# EAGLE board BMS-master (EAGLE 6.5.0), part 1 of 3
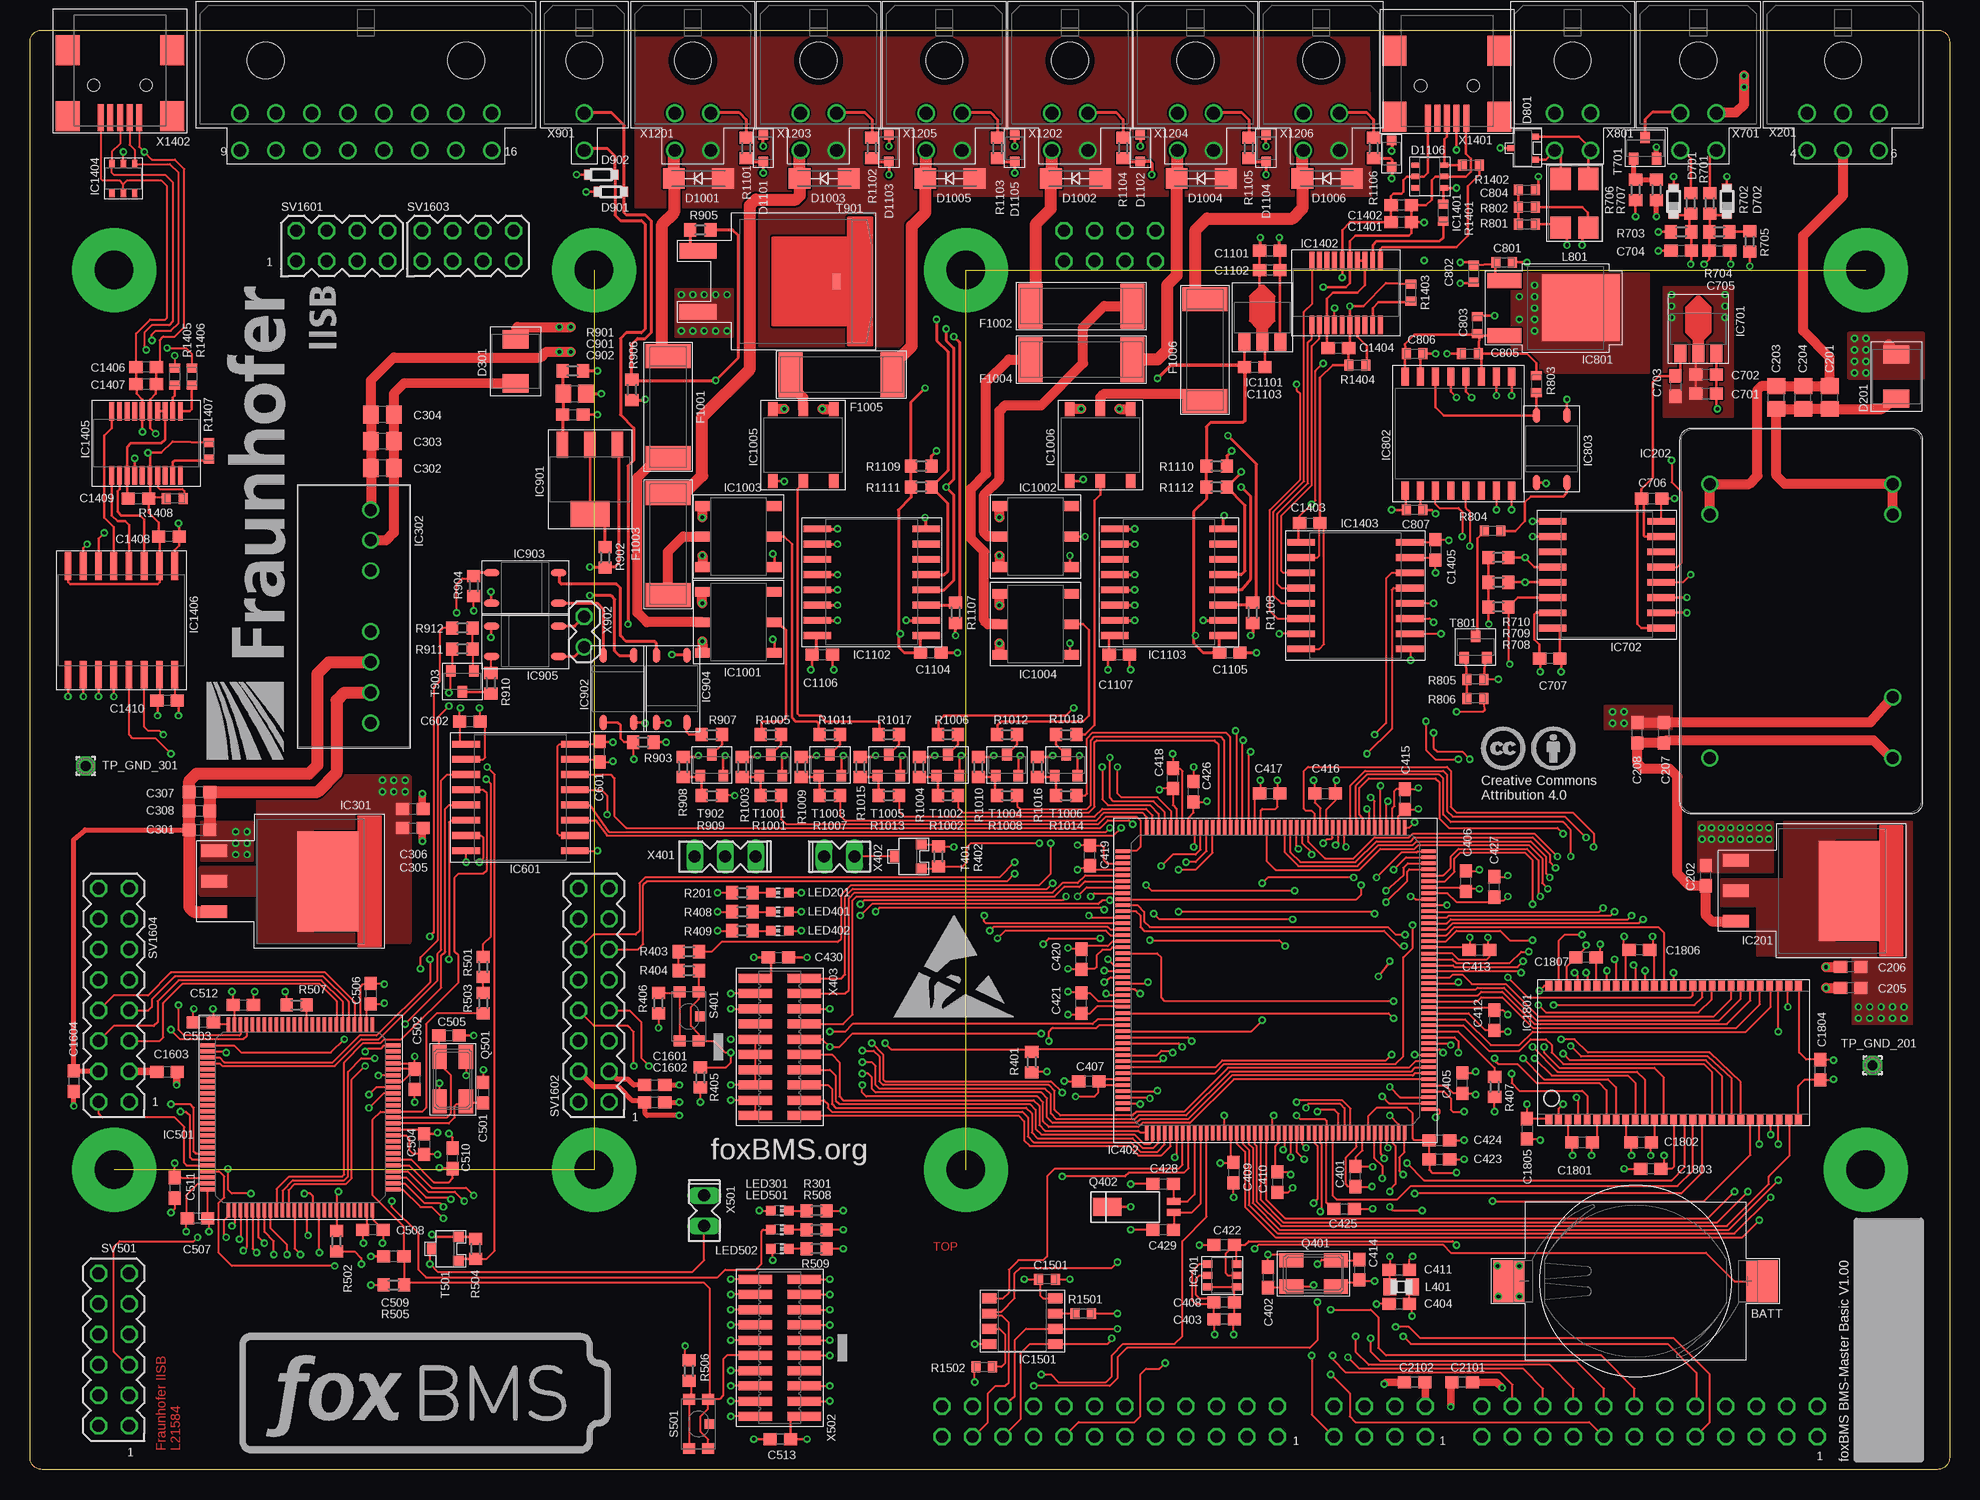
[diagram p22: board, top side]
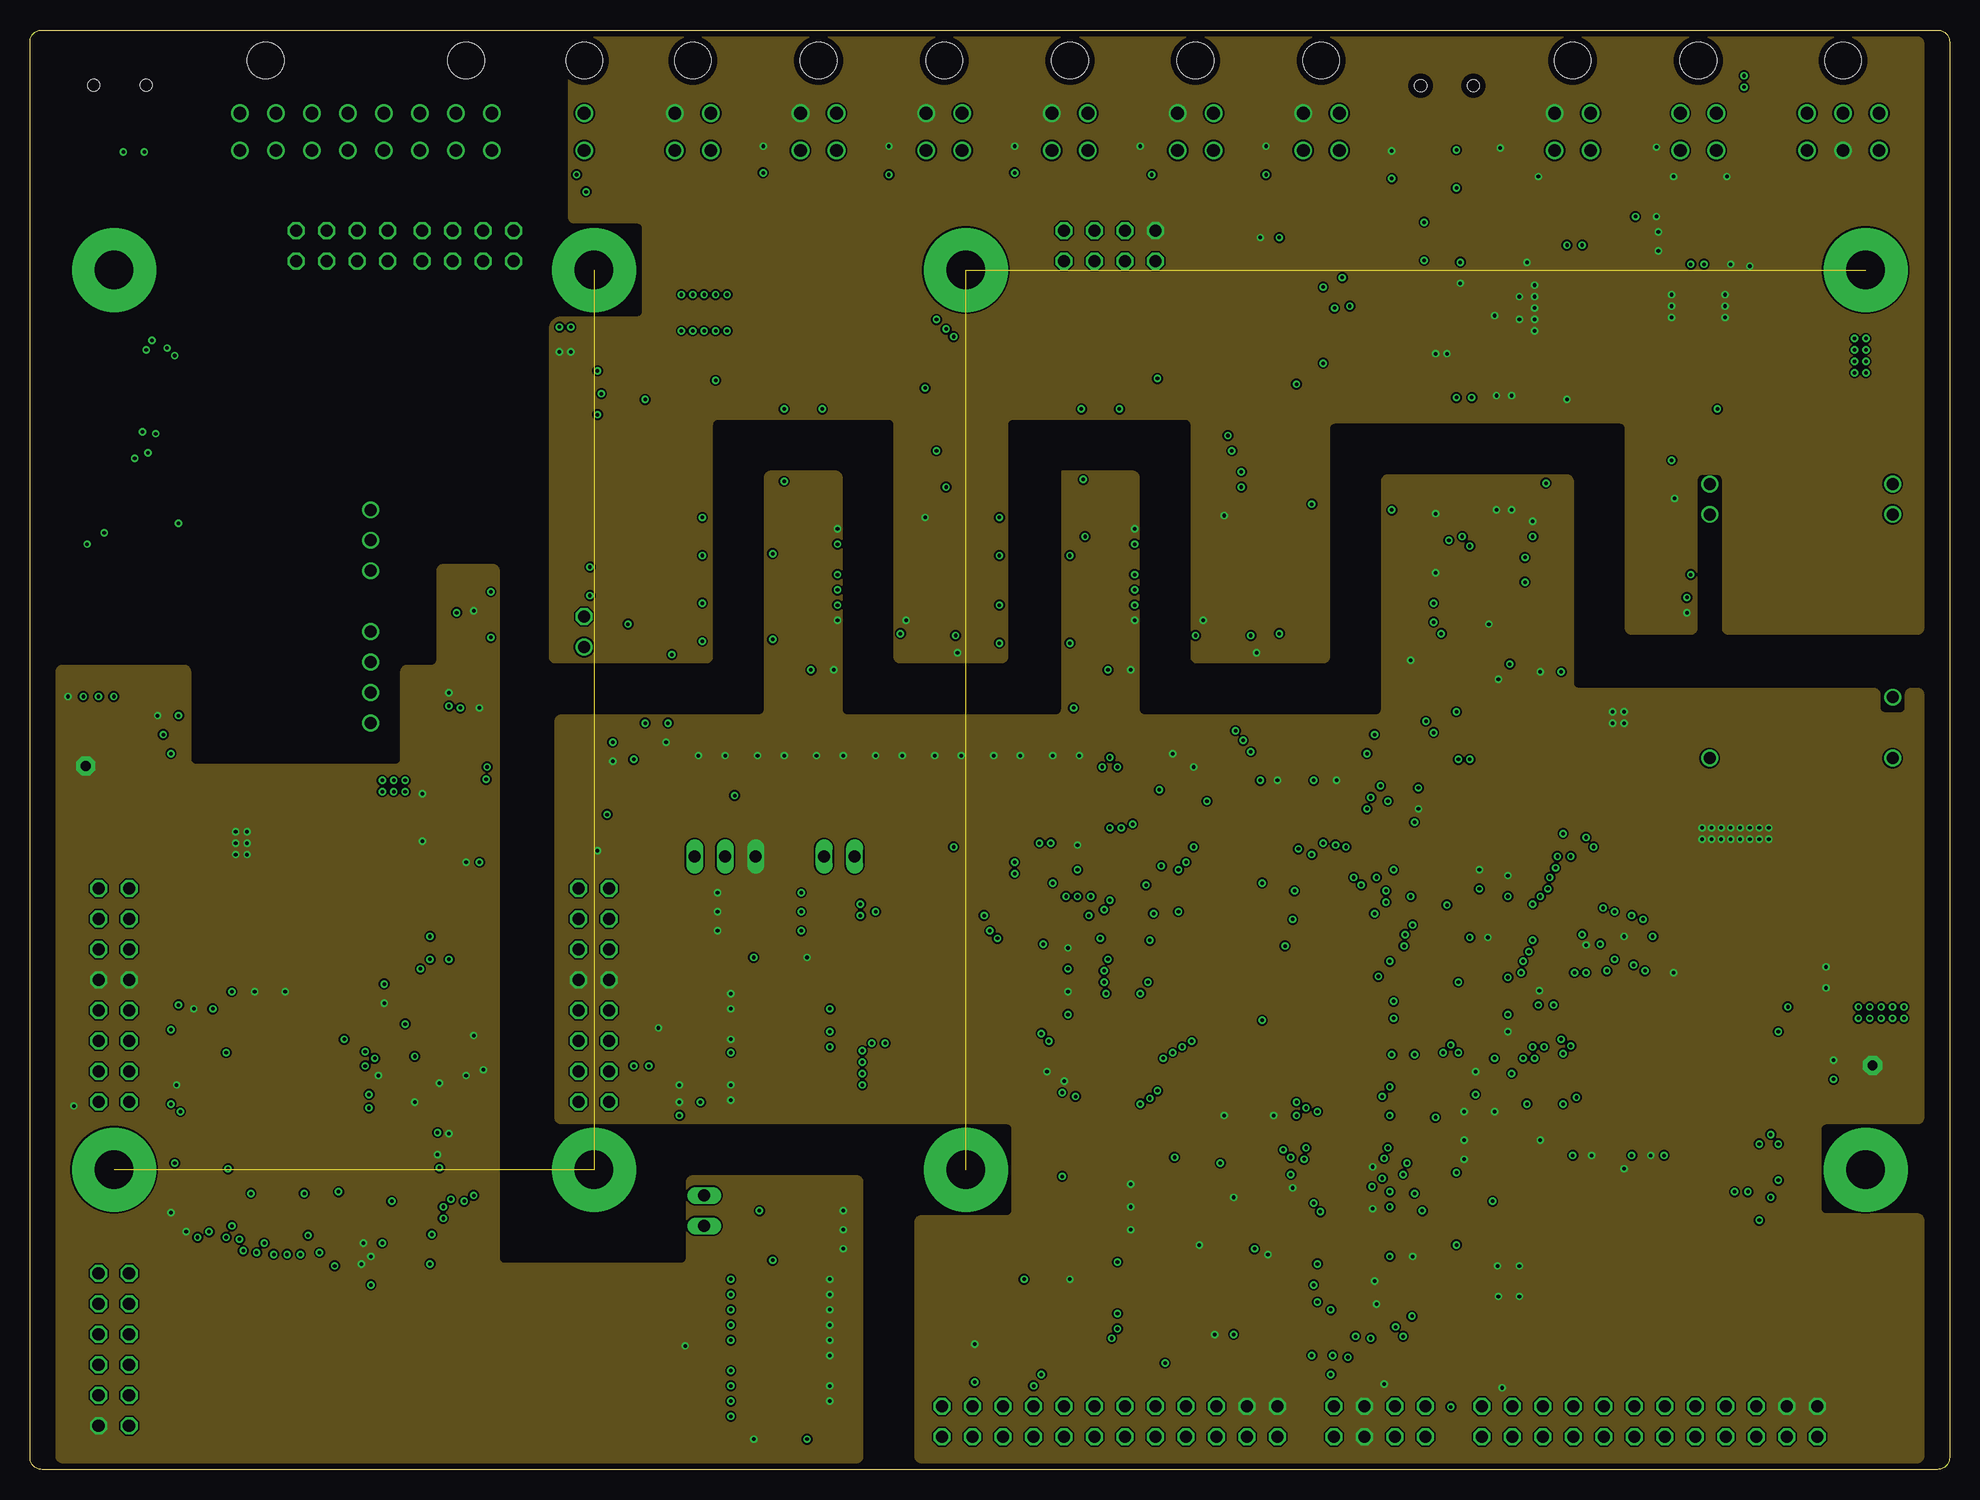
[diagram p23: board, inner layer Route2]
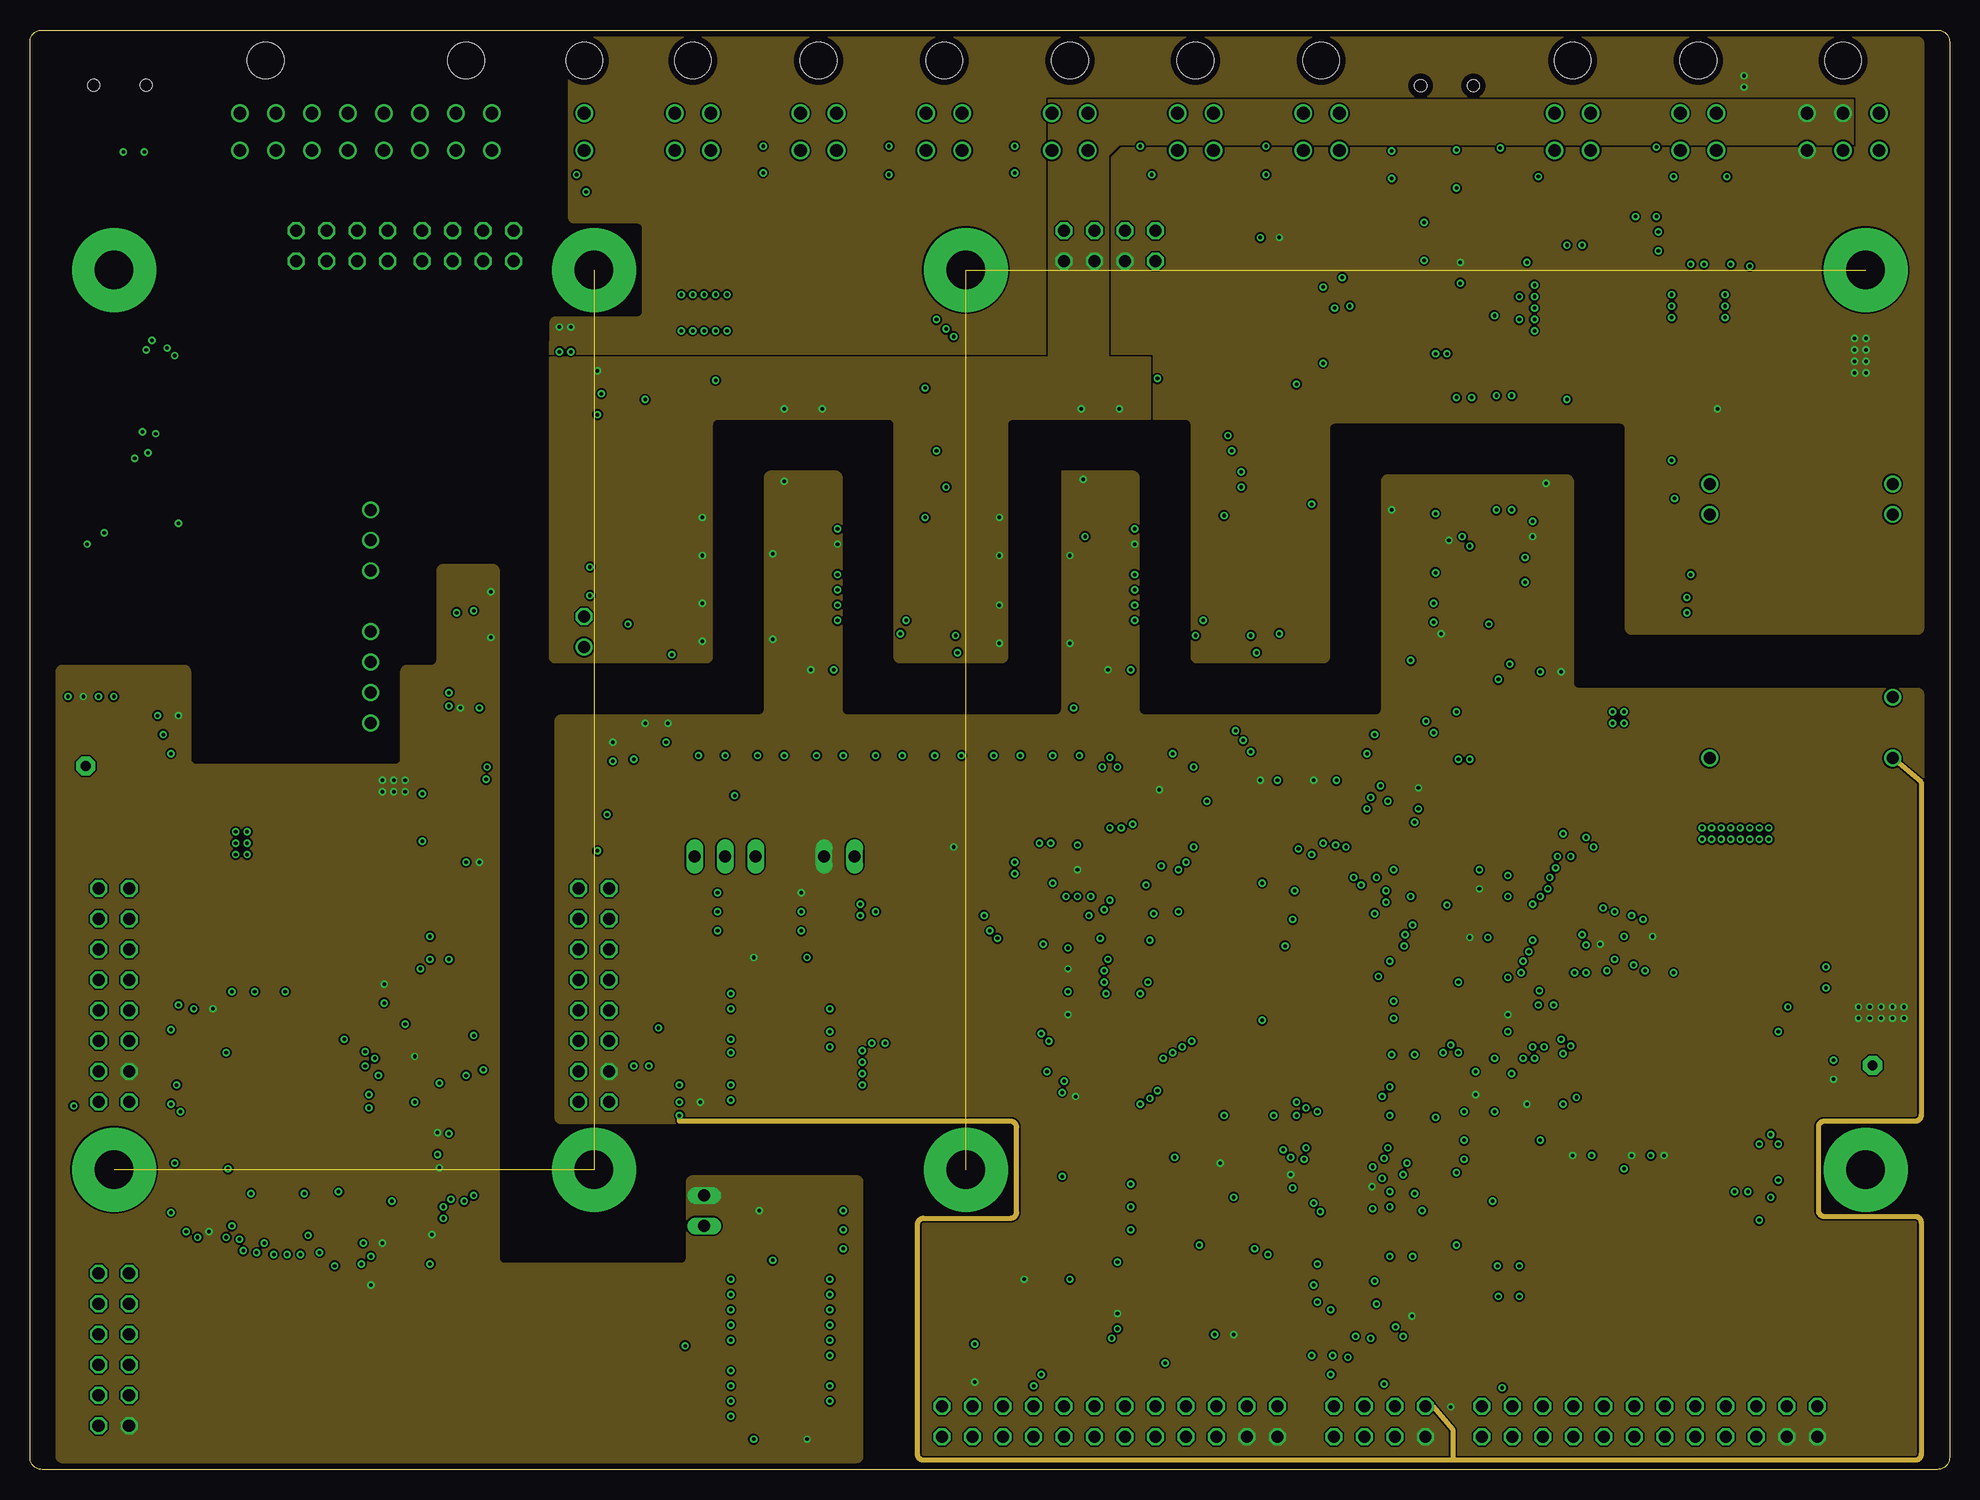
[diagram p24: board, inner layer Route3]
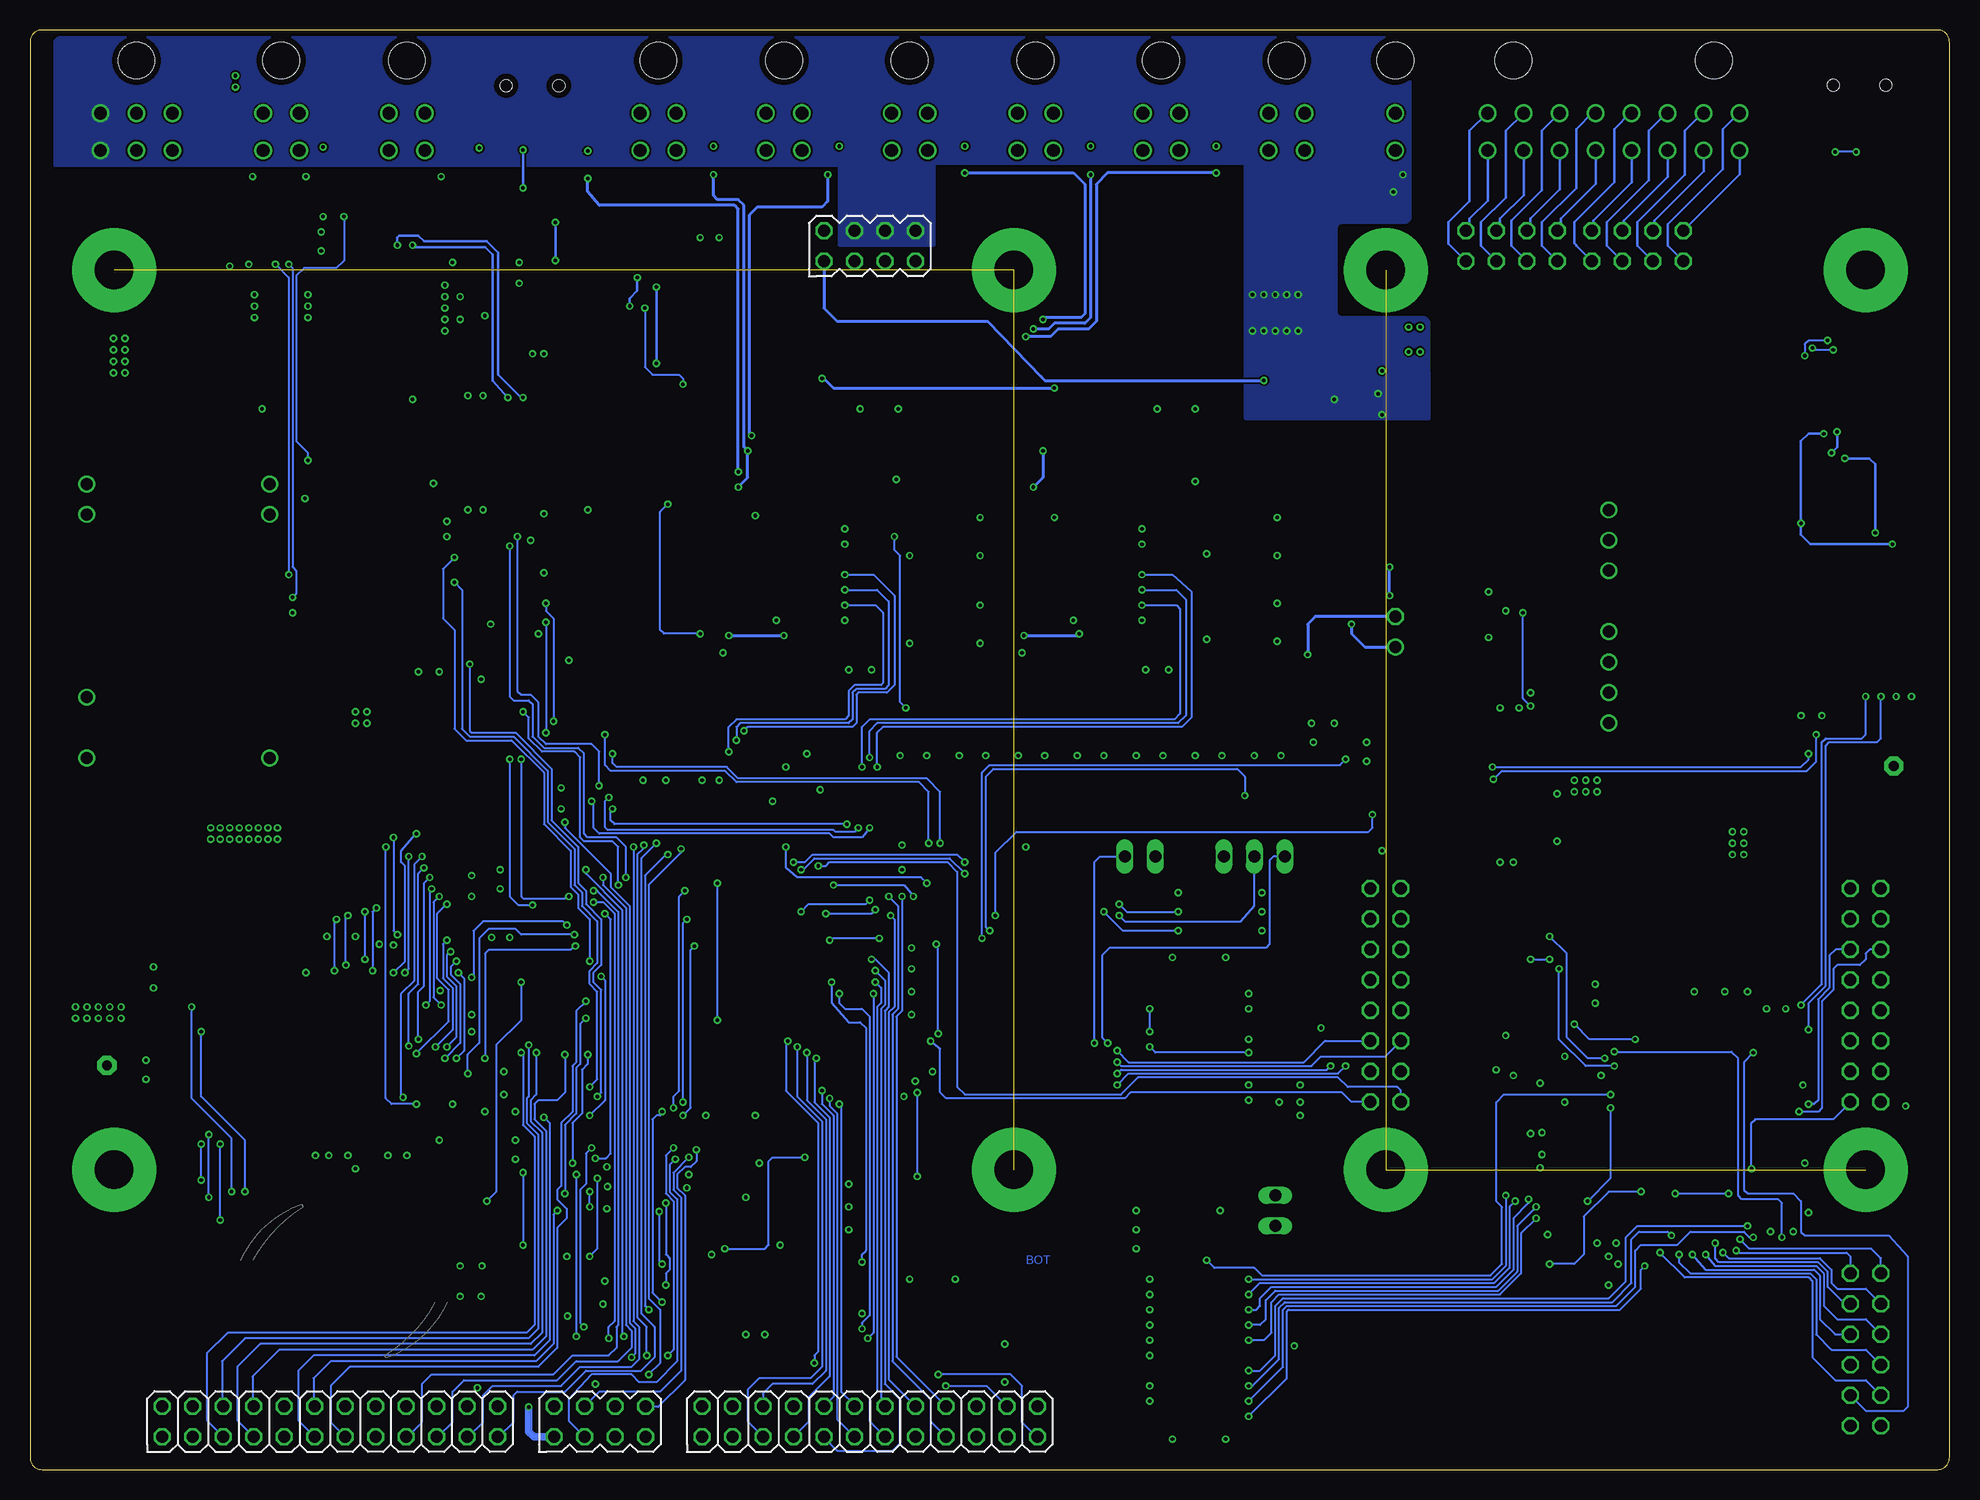
[diagram p25: board, bottom side, seen from below]

Size 160 x 120 mm. Coordinates in mm from the lower left corner, seen from the top.
Outline: 159,0 1,0 arc-90 0,1 0,119 arc-90 1,120 159,120 arc-90 160,119 160,1 arc-90 159,0
Copper layers (1+2*3+16): Top 0.018mm / dielectric 0.36mm / Route2 0.035mm / dielectric 0.71mm / Route3 0.035mm / dielectric 0.36mm / Bottom 0.018mm
Design rules "Aetzwerk-DRC 4 Lagen 35µm Cu": minimum track width 6mil, minimum drill 12mil, track to track 6mil, track to pad 6mil, pad to pad 6mil, via to via 6mil, smd to smd 6mil, copper to edge 20mil, drill to drill 8mil, minimum pad ring 8mil, minimum via ring 6mil, stop-mask expansion 3mil, vias tented up to drill 0mil, thermal gap 8mil
Net classes: 0 default: width 0.152 mm, clearance 0.152 mm; 1 controller: width 0.152 mm, clearance 0.152 mm to class 0, clearance 0.152 mm; 3 USB: width 0.152 mm, clearance 0.203 mm to class 0, clearance 0.203 mm to class 1, clearance 0.203 mm to class 2, clearance 0.152 mm; 4 Power: width 0.305 mm, clearance 0.152 mm to class 0, clearance 0.152 mm to class 1, clearance 0.152 mm to class 2, clearance 0.508 mm to class 3, clearance 0.152 mm
tKeepout: 21 lines

## Footprints (pad centres in the part's own frame; a part is rotated, then mirrored left to right if it is on the bottom)
X_SMD_(23,70MM_X_12,70MM_X_5,00MM)_R_RENATA_REV01 = smd 2.6 x 3.5: + -10.55,0; - 10.55,0
C0805 = smd 1.3 x 1.5: 1 -0.95,0; 2 0.95,0
C0603 = smd 1.1 x 1: 1 -0.85,0; 2 0.85,0
0603 = smd 0.75 x 0.9: 1 -0.7,0; 2 0.7,0
D_SMD_SMB_(DO-214AA)_R_VISHAY_REV01 = smd 1.52 x 2.18: A -1.839,0; C 1.839,0
SOD323 = smd 0.635 x 0.838: A 1.138,0; C -1.138,0
D_SMD_SOT23_(TO-236AB)_R_NXP_REV01 = smd 0.5 x 0.6: 1 -0.95,-1; 2 0.95,-1; 3 0,1
SMA-DO214AC = smd 1.8 x 1.7: A -2.05,0; K 2.05,0
D_SMD_SOD323_(SC-76)_R_BOURNS_REV01 = smd 0.8 x 0.8: A -1.1,0; C 1.1,0
F_SMD_11,00MMX3,00MMX3,00MM_(UMT)_R_SCHURTER_REV01 = smd 2 x 3.75: 1 -4.25,0; 2 4.25,0
IC_SMD_TO-263-3_(KTT0003B)_R_TI_REV01 = smd 1.067 x 2.159: 1 -2.54,-6.547; 2 0,-6.547; 3 2.54,-6.547 | smd 8.33 x 5.08: 4 0,2.902
IC_TH_32,00MMX20,00MMX10,00MM_(7-PIN)_R_MURATA_REV01 = drill 1: 2 -11.43,-7.62; 3 -8.89,-7.62; 11 11.43,-7.62; 14 11.43,7.62; 16 6.35,7.62; 22 -8.89,7.62; 23 -11.43,7.62
IC_TH_SIP8_R_RECOM_REV01 = drill 1: 1 -8.89,0; 2 -6.35,0; 3 -3.81,0; 5 1.27,0; 6 3.81,0; 7 6.35,0; 8 8.89,0
IC_SMD_SOT23-6_(MO-178-AB)_R_AD_REV01 = smd 0.6 x 0.8: 1 -0.95,-1.2; 2 0,-1.2; 3 0.95,-1.2; 4 0.95,1.2; 5 0,1.2; 6 -0.95,1.2
IC_SMD_LQFP176_R_ST_REV01 = smd 1.2 x 0.3: 1 -12.75,10.75; 2 -12.75,10.25; 3 -12.75,9.75; 4 -12.75,9.25; 5 -12.75,8.75; 6 -12.75,8.25; 7 -12.75,7.75; 8 -12.75,7.25; 9 -12.75,6.75; 10 -12.75,6.25; 11 -12.75,5.75; 12 -12.75,5.25; 13 -12.75,4.75; 14 -12.75,4.25; 15 -12.75,3.75; 16 -12.75,3.25; 17 -12.75,2.75; 18 -12.75,2.25; 19 -12.75,1.75; 20 -12.75,1.25; 21 -12.75,0.75; 22 -12.75,0.25; 23 -12.75,-0.25; 24 -12.75,-0.75; 25 -12.75,-1.25; 26 -12.75,-1.75; 27 -12.75,-2.2; 28 -12.75,-2.75; 29 -12.75,-3.25; 30 -12.75,-3.75; 31 -12.75,-4.25; 32 -12.75,-4.75; 33 -12.75,-5.25; 34 -12.75,-5.75; 35 -12.75,-6.25; 36 -12.75,-6.75; 37 -12.75,-7.25; 38 -12.75,-7.75; 39 -12.75,-8.254; 40 -12.75,-8.75; 41 -12.75,-9.25; 42 -12.75,-9.75; 43 -12.75,-10.25; 44 -12.75,-10.75; 89 12.75,-10.75; 90 12.75,-10.25; 91 12.75,-9.75; 92 12.75,-9.25; 93 12.75,-8.75; 94 12.75,-8.25; 95 12.75,-7.75; 96 12.75,-7.25; 97 12.75,-6.75; 98 12.75,-6.25; 99 12.75,-5.75; 100 12.75,-5.25; 101 12.75,-4.75; 102 12.75,-4.25; 103 12.75,-3.75; 104 12.75,-3.25; 105 12.75,-2.75; 106 12.75,-2.25; 107 12.75,-1.75; 108 12.75,-1.25; 109 12.75,-0.75; 110 12.75,-0.25; 111 12.75,0.25; 112 12.75,0.75; 113 12.75,1.25; 114 12.75,1.75; 115 12.75,2.2; 116 12.75,2.75; 117 12.75,3.25; 118 12.75,3.75; 119 12.75,4.25; 120 12.75,4.75; 121 12.75,5.25; 122 12.75,5.75; 123 12.75,6.25; 124 12.75,6.75; 125 12.75,7.25; 126 12.75,7.75; 127 12.75,8.254; 128 12.75,8.75; 129 12.75,9.25; 130 12.75,9.75; 131 12.75,10.25; 132 12.75,10.75 | smd 0.3 x 1.2: 45 -10.75,-12.75; 46 -10.25,-12.75; 47 -9.75,-12.75; 48 -9.25,-12.75; 49 -8.75,-12.75; 50 -8.25,-12.75; 51 -7.75,-12.75; 52 -7.25,-12.75; 53 -6.75,-12.75; 54 -6.25,-12.75; 55 -5.75,-12.75; 56 -5.25,-12.75; 57 -4.75,-12.75; 58 -4.25,-12.75; 59 -3.75,-12.75; 60 -3.25,-12.75; 61 -2.75,-12.75; 62 -2.25,-12.75; 63 -1.75,-12.75; 64 -1.25,-12.75; 65 -0.75,-12.75; 66 -0.25,-12.75; 67 0.25,-12.75; 68 0.75,-12.75; 69 1.25,-12.75; 70 1.75,-12.75; 71 2.2,-12.75; 72 2.75,-12.75; 73 3.25,-12.75; 74 3.75,-12.75; 75 4.25,-12.75; 76 4.75,-12.75; 77 5.25,-12.75; 78 5.75,-12.75; 79 6.25,-12.75; 80 6.75,-12.75; 81 7.25,-12.75; 82 7.75,-12.75; 83 8.254,-12.75; 84 8.75,-12.75; 85 9.25,-12.75; 86 9.75,-12.75; 87 10.25,-12.75; 88 10.75,-12.75; 133 10.75,12.75; 134 10.25,12.75; 135 9.75,12.75; 136 9.25,12.75; 137 8.75,12.75; 138 8.25,12.75; 139 7.75,12.75; 140 7.25,12.75; 141 6.75,12.75; 142 6.25,12.75; 143 5.75,12.75; 144 5.25,12.75; 145 4.75,12.75; 146 4.25,12.75; 147 3.75,12.75; 148 3.25,12.75; 149 2.75,12.75; 150 2.25,12.75; 151 1.75,12.75; 152 1.25,12.75; 153 0.75,12.75; 154 0.25,12.75; 155 -0.25,12.75; 156 -0.75,12.75; 157 -1.25,12.75; 158 -1.75,12.75; 159 -2.2,12.75; 160 -2.75,12.75; 161 -3.25,12.75; 162 -3.75,12.75; 163 -4.25,12.75; 164 -4.75,12.75; 165 -5.25,12.75; 166 -5.75,12.75; 167 -6.25,12.75; 168 -6.75,12.75; 169 -7.25,12.75; 170 -7.75,12.75; 171 -8.254,12.75; 172 -8.75,12.75; 173 -9.25,12.75; 174 -9.75,12.75; 175 -10.25,12.75; 176 -10.75,12.75
IC_SMD_LQFP100_R_ST_REV01 = smd 0.3 x 1.2: 1 -6,-7.75; 2 -5.5,-7.75; 3 -5,-7.75; 4 -4.5,-7.75; 5 -4,-7.75; 6 -3.5,-7.75; 7 -3,-7.75; 8 -2.5,-7.75; 9 -2,-7.75; 10 -1.5,-7.75; 11 -1,-7.75; 12 -0.5,-7.75; 13 0,-7.75; 14 0.5,-7.75; 15 1,-7.75; 16 1.5,-7.75; 17 2,-7.75; 18 2.5,-7.75; 19 3,-7.75; 20 3.5,-7.75; 21 4,-7.75; 22 4.5,-7.75; 23 5,-7.75; 24 5.5,-7.75; 25 6,-7.75; 51 6,7.75; 52 5.5,7.75; 53 5,7.75; 54 4.5,7.75; 55 4,7.75; 56 3.5,7.75; 57 3,7.75; 58 2.5,7.75; 59 2,7.75; 60 1.5,7.75; 61 1,7.75; 62 0.5,7.75; 63 0,7.75; 64 -0.5,7.75; 65 -1,7.75; 66 -1.5,7.75; 67 -2,7.75; 68 -2.5,7.75; 69 -3,7.75; 70 -3.5,7.75; 71 -4,7.75; 72 -4.5,7.75; 73 -5,7.75; 74 -5.5,7.75; 75 -6,7.75 | smd 1.2 x 0.3: 26 7.75,-6; 27 7.75,-5.5; 28 7.75,-5; 29 7.75,-4.5; 30 7.75,-4; 31 7.75,-3.5; 32 7.75,-3; 33 7.75,-2.5; 34 7.75,-2; 35 7.75,-1.5; 36 7.75,-1; 37 7.75,-0.5; 38 7.75,0; 39 7.75,0.5; 40 7.75,1; 41 7.75,1.5; 42 7.75,2; 43 7.75,2.5; 44 7.75,3; 45 7.75,3.5; 46 7.75,4; 47 7.75,4.5; 48 7.75,5; 49 7.75,5.5; 50 7.75,6; 76 -7.75,6; 77 -7.75,5.5; 78 -7.75,5; 79 -7.75,4.5; 80 -7.75,4; 81 -7.75,3.5; 82 -7.75,3; 83 -7.75,2.5; 84 -7.75,2; 85 -7.75,1.5; 86 -7.75,1; 87 -7.75,0.5; 88 -7.75,0; 89 -7.75,-0.5; 90 -7.75,-1; 91 -7.75,-1.5; 92 -7.75,-2; 93 -7.75,-2.5; 94 -7.75,-3; 95 -7.75,-3.5; 96 -7.75,-4; 97 -7.75,-4.5; 98 -7.75,-5; 99 -7.75,-5.5; 100 -7.75,-6
IC_SMD_SOIC-16_(JEDEC_MS-013-AA)_R_ANALOG_REV01 = smd 0.56 x 2.3: 1 -4.445,-4.527; 2 -3.175,-4.527; 3 -1.905,-4.527; 4 -0.635,-4.527; 5 0.635,-4.527; 6 1.905,-4.527; 7 3.175,-4.527; 8 4.445,-4.527; 9 4.445,4.527; 10 3.175,4.527; 11 1.905,4.527; 12 0.635,4.527; 13 -0.635,4.527; 14 -1.905,4.527; 15 -3.175,4.527; 16 -4.445,4.527
IC_SMD_SOT-89_(SC-62/TO-243)_(R-PSSO-F3)_R_TI_REV01 = smd 1 x 1.5: 1 -1.5,-2; 2 0,-2; 3 1.5,-2
IC_SMD_TO-252_(D-PAK)_R_FAIRCHILD_REV01 = smd 1.25 x 2.85: 1 -2.28,-4.112; 3 2.288,-4.112 | smd 5.55 x 6.5: 2 0,2.288
IC_SMD_SO16_(SOT162-1)_R_NXP_REV01 = smd 0.6 x 1.5: 1 -4.445,-4.75; 2 -3.175,-4.75; 3 -1.905,-4.75; 4 -0.635,-4.75; 5 0.635,-4.75; 6 1.905,-4.75; 7 3.175,-4.75; 8 4.445,-4.75; 9 4.445,4.75; 10 3.175,4.75; 11 1.905,4.75; 12 0.635,4.75; 13 -0.635,4.75; 14 -1.905,4.75; 15 -3.175,4.75; 16 -4.445,4.75
K_SMD_SOP-4_R_IXYS_REV01 = smd 0.6 x 1.3: 1 -1.27,-2.8; 2 1.27,-2.8; 3 1.27,2.8; 4 -1.27,2.8
IC_SMD_SOT-223_(TO-261)_(CASE318E-04)_R_REV01 = smd 0.95 x 2.15: 1 -2.3,-2.9; 2 0,-2.9; 3 2.3,-2.9 | smd 3.25 x 2.15: 4 0,2.9
K_SMD_SOP-6_R_PANASONIC_REV01 = smd 0.8 x 1.2: 1 -2.54,-3; 2 0,-3; 3 2.54,-3; 4 2.54,3; 5 0,3; 6 -2.54,3
D_SMD_TSOP6_(SOT457/SC-74)_R_NXP_REV01 = smd 0.45 x 0.7: 1 -0.95,-1.2; 2 0,-1.2; 3 0.95,-1.2; 4 0.95,1.2; 5 0,1.2; 6 -0.95,1.2
IC_SMD_SSOP-20_R_FTDI_REV01 = smd 0.406 x 1.524: 1 -2.857,-2.667; 2 -2.223,-2.667; 3 -1.587,-2.667; 4 -0.953,-2.667; 5 -0.318,-2.667; 6 0.318,-2.667; 7 0.953,-2.667; 8 1.587,-2.667; 9 2.223,-2.667; 10 2.857,-2.667; 11 2.857,2.667; 12 2.223,2.667; 13 1.587,2.667; 14 0.953,2.667; 15 0.318,2.667; 16 -0.318,2.667; 17 -0.953,2.667; 18 -1.587,2.667; 19 -2.223,2.667; 20 -2.857,2.667
IC_SMD_SOIC-8_R_ATMEL_REV01 = smd 0.8 x 1.2: 1 -1.905,-2.74; 2 -0.635,-2.74; 3 0.635,-2.74; 4 1.905,-2.74; 5 1.905,2.74; 6 0.635,2.74; 7 -0.635,2.74; 8 -1.905,2.74
IC_SMD_TSOP-II_(54-PIN)_R_ISSI_REV01 = smd 0.56 x 0.8: 1 -10.4,-5.562; 2 -9.6,-5.562; 3 -8.8,-5.562; 4 -8,-5.562; 5 -7.2,-5.562; 6 -6.4,-5.562; 7 -5.6,-5.562; 8 -4.8,-5.562; 9 -4,-5.562; 10 -3.2,-5.562; 11 -2.4,-5.562; 12 -1.6,-5.562; 13 -0.8,-5.562; 14 0,-5.562; 15 0.8,-5.562; 16 1.6,-5.562; 17 2.4,-5.562; 18 3.2,-5.562; 19 4,-5.562; 20 4.8,-5.562; 21 5.6,-5.562; 22 6.4,-5.562; 23 7.2,-5.562; 24 8,-5.562; 25 8.8,-5.562; 26 9.6,-5.562; 27 10.4,-5.562; 28 10.4,5.562; 29 9.6,5.562; 30 8.8,5.562; 31 8,5.562; 32 7.2,5.562; 33 6.4,5.562; 34 5.6,5.562; 35 4.8,5.562; 36 4,5.562; 37 3.2,5.562; 38 2.4,5.562; 39 1.6,5.562; 40 0.8,5.562; 41 0,5.562; 42 -0.8,5.562; 43 -1.6,5.562; 44 -2.4,5.562; 45 -3.2,5.562; 46 -4,5.562; 47 -4.8,5.562; 48 -5.6,5.562; 49 -6.4,5.562; 50 -7.2,5.562; 51 -8,5.562; 52 -8.8,5.562; 53 -9.6,5.562; 54 -10.4,5.562
2X12 = drill 1.016 octagon: 1 -13.97,-1.27; 2 -13.97,1.27; 3 -11.43,-1.27; 4 -11.43,1.27; 5 -8.89,-1.27; 6 -8.89,1.27; 7 -6.35,-1.27; 8 -6.35,1.27; 9 -3.81,-1.27; 10 -3.81,1.27; 11 -1.27,-1.27; 12 -1.27,1.27; 13 1.27,-1.27; 14 1.27,1.27; 15 3.81,-1.27; 16 3.81,1.27; 17 6.35,-1.27; 18 6.35,1.27; 19 8.89,-1.27; 20 8.89,1.27; 21 11.43,-1.27; 22 11.43,1.27; 23 13.97,-1.27; 24 13.97,1.27
0805 = smd 1.092 x 1.397: 1 -0.94,0; 2 0.94,0
L_SMD_FILTER_HF_R_EPCOS_SIMDAD_1812_REV01 = smd 1.85 x 1.7: 1 -2.025,1.15; 2 -2.025,-1.15; 3 2.025,-1.15; 4 2.025,1.15
CHIP-LED0603 = smd 0.8 x 0.8: A 0,-0.75; C 0,0.75
G_SMD_5,00MM_X_3,20MM_0,90MM_(7B)_TXC_REV01 = smd 2 x 1.2: 1 -1.85,-1.1; 2 1.85,-1.1; 3 1.85,1.1; 4 -1.85,1.1
MS3V-T1R = smd 1.1 x 0.6: 1 3.1,0.45; 2 3.1,-0.45 | smd 2.4 x 1.5: P$3 -2.45,0
R0603 = smd 1 x 1.1: 1 -0.85,0; 2 0.85,0
S_SMD_4,60MMX2,80MMX1,90MM_R_CK-COMPONENTS_REV01 = smd 0.9 x 1: 1 -2.05,-0.8; 2 2.05,-0.8; 3 2.05,0.8; 4 -2.05,0.8 | smd 0.8 x 0.8: 5 0,0.9
MA06-2 = drill 1.016 octagon: 1 -6.35,-1.27; 2 -6.35,1.27; 3 -3.81,-1.27; 4 -3.81,1.27; 5 -1.27,-1.27; 6 -1.27,1.27; 7 1.27,-1.27; 8 1.27,1.27; 9 3.81,-1.27; 10 3.81,1.27; 11 6.35,-1.27; 12 6.35,1.27
MA04-2 = drill 1.016 octagon: 1 -3.81,-1.27; 2 -3.81,1.27; 3 -1.27,-1.27; 4 -1.27,1.27; 5 1.27,-1.27; 6 1.27,1.27; 7 3.81,-1.27; 8 3.81,1.27
MA08-2 = drill 1.016 octagon: 1 -8.89,-1.27; 2 -8.89,1.27; 3 -6.35,-1.27; 4 -6.35,1.27; 5 -3.81,-1.27; 6 -3.81,1.27; 7 -1.27,-1.27; 8 -1.27,1.27; 9 1.27,-1.27; 10 1.27,1.27; 11 3.81,-1.27; 12 3.81,1.27; 13 6.35,-1.27; 14 6.35,1.27; 15 8.89,-1.27; 16 8.89,1.27
V_SMD_SOT23_(TO-236AB)_R_INFINEON_REV01 = smd 0.8 x 0.9: 1 -1,-1.1; 2 1,-1.1 | smd 0.9 x 0.8: 3 0,1.1
V_SMD_SOT-23_(TO-236AB)_R_IR_REV01 = smd 0.802 x 0.972: 1 -0.95,-0.885; 2 0.95,-0.885; 3 0,0.885
V_SMD_TO-263_(D²PAK)_R_NXP_REV01 = smd 1.3 x 3.1: 1 -2.54,-6.55; 3 2.54,-6.55 | smd 1.27 x 0.635: 2 0,5
1,6/0,8 = drill 0.813 pad 1.6 octagon: 1 0,0
X_TH_MOLEX_43045-0600_R_REV01 = drill 1.07: 1 3,4.4; 2 0,4.4; 3 -3,4.4; 4 3,7.5; 5 0,7.5; 6 -3,7.5 | hole 3.05: 0,0
MA03-1 = drill 1.016 long: 1 -2.54,0; 2 0,0; 3 2.54,0
MA02-1 = drill 1.016 long: 1 -1.27,0; 2 1.27,0
X_SMD_FTS_110-03_(20POL)_R_SAMTEC_REV01 = smd 0.74 x 2.79: 1 -5.715,-2.035; 2 -5.715,2.035; 3 -4.445,-2.035; 4 -4.445,2.035; 5 -3.175,-2.035; 6 -3.175,2.035; 7 -1.905,-2.035; 8 -1.905,2.035; 9 -0.635,-2.035; 10 -0.635,2.035; 11 0.635,-2.035; 12 0.635,2.035; 13 1.905,-2.035; 14 1.905,2.035; 15 3.175,-2.035; 16 3.175,2.035; 17 4.445,-2.035; 18 4.445,2.035; 19 5.715,-2.035; 20 5.715,2.035
X_TH_MOLEX_43045-0400_R_REV01 = drill 1.07: 1 1.5,4.4; 2 -1.5,4.4; 3 1.5,7.5; 4 -1.5,7.5 | hole 3.05: 0,0
X_TH_MOLEX_43045-0200_R_REV01 = drill 1.07: 1 0,4.4; 2 0,7.5 | hole 3.05: 0,0
MA02-1A = drill 1.016: 1 -1.27,0 | drill 1.016 octagon: 2 1.27,0
X_SMD_MINI-USB-2.0-TYPAB_R_MULTICOMP_REV01 = smd 0.5 x 2.25: 1 -1.6,3.72; 2 -0.8,3.72; 3 0,3.72; 4 0.8,3.72; 5 1.6,3.72 | smd 2 x 2.5: SH1 -4.365,-1.905; SH2 4.365,-1.905; SH3 4.365,3.595; SH4 -4.365,3.595 | hole 1: -2.2,1.005; 2.2,1.005
X_TH_MOLEX_43045-1600_R_REV01 = drill 1.07: 1 10.5,4.4; 2 7.5,4.4; 3 4.5,4.4; 4 1.5,4.4; 5 -1.5,4.4; 6 -4.5,4.4; 7 -7.5,4.4; 8 -10.5,4.4; 9 10.5,7.5; 10 7.5,7.5; 11 4.5,7.5; 12 1.5,7.5; 13 -1.5,7.5; 14 -4.5,7.5; 15 -7.5,7.5; 16 -10.5,7.5 | hole 3.05: 8.35,0; -8.35,0

## Placement (x,y rotation side)
BATT  SMTU1225-LF  [X_SMD_(23,70MM_X_12,70MM_X_5,00MM)_R_RENATA_REV01]  133.83,15.7 180 top
C201  2.2µ  [C0805]  150.02,89.36 90 top
C202  100n  [C0603]  139.7,49.52 90 top
C203  2.2µ  [C0805]  145.57,89.36 90 top
C204  2.2µ  [C0805]  147.8,89.36 90 top
C205  1µ  [C0603]  151.76,40.15 180 top
C206  100n  [C0603]  151.76,41.89 180 top
C207  1µ  [C0603]  136.21,61.42 90 top
C208  100n  [C0603]  133.99,61.42 90 top
C301  100n  [C0603]  14.13,53.33 0 top
C302  2.2µ  [C0805]  29.37,83.49 180 top
C303  2.2µ  [C0805]  29.37,85.71 180 top
C304  2.2µ  [C0805]  29.37,87.93 180 top
C305  1µ  [C0603]  31.91,53.48 0 top
C306  100n  [C0603]  31.91,55.07 0 top
C307  1µ  [C0603]  14.13,56.5 0 top
C308  100n  [C0603]  14.13,54.91 0 top
C401  100n  [C0603]  110.49,24.43 90 top
C402  18p  [C0603]  103.19,16.02 270 top
C403  1µ  [C0603]  99.54,12.53 180 top
C404  100n  [C0603]  114.14,13.8 180 top
C405  100n  [C0603]  119.38,32.21 90 top
C406  100n  [C0603]  119.7,49.04 90 top
C407  100n  [C0603]  88.27,32.37 180 top
C408  100n  [C0603]  99.54,13.95 180 top
C409  100n  [C0603]  100.33,24.75 270 top
C410  100n  [C0603]  103.98,23.96 270 top
C411  100n  [C0603]  114.14,16.65 0 top
C412  100n  [C0603]  122.08,37.45 270 top
C413  100n  [C0603]  120.81,43.32 0 top
C414  18p  [C0603]  110.81,16.65 270 top
C415  100n  [C0603]  114.62,55.86 270 top
C416  100n  [C0603]  107.95,56.34 0 top
C417  100n  [C0603]  103.35,56.34 0 top
C418  100n  [C0603]  95.25,57.61 90 top
C419  100n  [C0603]  88.34,51.18 90 top
C420  100n  [C0603]  87.63,42.53 90 top
C421  100n  [C0603]  87.63,38.88 90 top
C422  100n  [C0603]  99.54,18.72 180 top
C423  1µ  [C0603]  117.47,25.86 0 top
C424  100n  [C0603]  117.47,27.45 0 top
C425  100n  [C0603]  109.54,21.73 0 top
C426  2.2µ  [C0603]  97,56.5 90 top
C427  2.2µ  [C0603]  122.08,48.56 90 top
C428  18p  [C0603]  94.46,23.8 0 top
C429  18p  [C0603]  94.46,19.99 180 top
C430  100n  [C0603]  62.39,42.69 0 top
C501  18p  [C0603]  37.78,31.42 270 top
C502  100n  [C0603]  32.07,32.53 270 top
C503  100n  [C0603]  14.45,37.29 180 top
C504  100n  [C0603]  32.86,27.13 270 top
C505  18p  [C0603]  34.92,36.18 0 top
C506  100n  [C0603]  28.42,39.67 270 top
C507  100n  [C0603]  13.97,20.94 180 top
C508  100n  [C0603]  28.57,19.99 180 top
C509  100n  [C0603]  30.32,17.77 180 top
C510  100n  [C0603]  35.24,25.94 90 top
C511  2.2µ  [C0603]  12.06,23.48 270 top
C512  2.2µ  [C0603]  17.78,38.72 0 top
C513  100n  [C0603]  62.55,2.53 180 top
C601  100n  [C0603]  47.47,59.83 90 top
C602  100n  [C0603]  36.67,62.37 0 top
C701  1µ  [C0603]  139.7,89.68 180 top
C702  100n  [C0603]  139.7,91.27 180 top
C703  100n  [C0603]  137.16,90.31 270 top
C704  18p  [C0603]  137.64,101.59 180 top
C705  18p  [C0603]  140.81,101.59 0 top
C706  100n  [C0603]  135.18,80.95 0 top
C707  100n  [C0603]  126.68,67.61 180 top
C801  1µ  [0603]  122.87,100.63 180 top
C802  100n  [0603]  120.33,99.68 90 top
C803  100n  [0603]  120.65,95.39 270 top
C804  100n  [0603]  124.78,106.66 0 top
C805  100n  [0603]  120.02,93.01 0 top
C806  100n  [0603]  115.41,93.01 180 top
C807  100n  [0603]  115.41,80 180 top
C901  2.2µ  [C0805]  45.4,89.68 0 top
C902  100n  [C0603]  45.24,87.93 0 top
C1101  1µ  [C0603]  103.35,101.59 180 top
C1102  100n  [C0603]  103.35,100 180 top
C1103  100n  [C0603]  102.08,91.9 0 top
C1104  100n  [C0603]  75.09,68.09 0 top
C1105  100n  [C0603]  100.01,68.09 0 top
C1106  100n  [C0603]  66.04,67.93 0 top
C1107  100n  [C0603]  90.81,67.93 0 top
C1401  4.7µ  [C0603]  114.3,103.97 180 top
C1402  100n  [C0603]  114.3,105.39 180 top
C1403  100n  [C0603]  106.68,78.88 0 top
C1404  100n  [C0603]  109.06,93.49 0 top
C1405  100n  [C0603]  117.16,76.66 270 top
C1406  4.7µ  [C0603]  9.68,91.9 180 top
C1407  100n  [C0603]  9.68,90.47 180 top
C1408  100n  [C0603]  11.59,77.77 180 top
C1409  100n  [C0603]  9.05,80.95 0 top
C1410  100n  [C0603]  11.43,64.12 180 top
C1501  100n  [0603]  84.77,15.86 180 top
C1601  100n  [C0603]  52.07,32.05 0 top
C1602  100n  [C0603]  52.07,30.62 0 top
C1603  100n  [C0603]  11.43,33.16 0 top
C1604  100n  [C0603]  3.65,32.37 270 top
C1801  100n  [C0603]  129.38,27.29 0 top
C1802  100n  [C0603]  134.3,27.29 0 top
C1803  100n  [C0603]  135.1,25.07 180 top
C1804  100n  [C0603]  149.22,33.32 90 top
C1805  100n  [C0603]  124.78,28.4 270 top
C1806  100n  [C0603]  134.14,43.32 180 top
C1807  100n  [C0603]  129.7,42.69 180 top
C2101  100n  [C0603]  119.38,7.29 180 top
C2102  100n  [C0603]  115.41,7.29 180 top
D201  VS-10BQ040-M3  [D_SMD_SMB_(DO-214AA)_R_VISHAY_REV01]  155.57,91.11 270 top
D301  VS-10BQ040-M3  [D_SMD_SMB_(DO-214AA)_R_VISHAY_REV01]  40.48,92.38 270 top
D701  4.7V  [SOD323]  137,105.71 90 top
D702  4.7V  [SOD323]  141.45,105.71 90 top
D801  PESD1CAN  [D_SMD_SOT23_(TO-236AB)_R_NXP_REV01]  124.46,110.16 90 top
D901  MM3Z_XVX_T1  [SOD323]  48.42,106.51 180 top
D902  MM3Z_XVX_T1  [SOD323]  47.62,107.94 180 top
D1001  GF1  [SMA-DO214AC]  55.72,107.62 180 top
D1002  GF1  [SMA-DO214AC]  87.15,107.62 180 top
D1003  GF1  [SMA-DO214AC]  66.2,107.62 180 top
D1004  GF1  [SMA-DO214AC]  97.63,107.62 180 top
D1005  GF1  [SMA-DO214AC]  76.68,107.62 180 top
D1006  GF1  [SMA-DO214AC]  108.11,107.62 180 top
D1101  CDSOD323-T05  [D_SMD_SOD323_(SC-76)_R_BOURNS_REV01]  61.12,110.16 270 top
D1102  CDSOD323-T05  [D_SMD_SOD323_(SC-76)_R_BOURNS_REV01]  92.55,110.16 270 top
D1103  CDSOD323-T05  [D_SMD_SOD323_(SC-76)_R_BOURNS_REV01]  71.6,110.16 270 top
D1104  CDSOD323-T05  [D_SMD_SOD323_(SC-76)_R_BOURNS_REV01]  103.03,110.16 270 top
D1105  CDSOD323-T05  [D_SMD_SOD323_(SC-76)_R_BOURNS_REV01]  82.07,110.16 270 top
D1106  CDSOD323-T05  [D_SMD_SOD323_(SC-76)_R_BOURNS_REV01]  113.51,109.68 270 top
F1001  630MA_UMT  [F_SMD_11,00MMX3,00MMX3,00MM_(UMT)_R_SCHURTER_REV01]  53.18,88.57 90 top
F1002  630MA_UMT  [F_SMD_11,00MMX3,00MMX3,00MM_(UMT)_R_SCHURTER_REV01]  87.63,96.98 180 top
F1003  630MA_UMT  [F_SMD_11,00MMX3,00MMX3,00MM_(UMT)_R_SCHURTER_REV01]  53.18,77.14 90 top
F1004  630MA_UMT  [F_SMD_11,00MMX3,00MMX3,00MM_(UMT)_R_SCHURTER_REV01]  87.63,92.54 0 top
F1005  630MA_UMT  [F_SMD_11,00MMX3,00MMX3,00MM_(UMT)_R_SCHURTER_REV01]  67.63,91.27 0 top
F1006  630MA_UMT  [F_SMD_11,00MMX3,00MMX3,00MM_(UMT)_R_SCHURTER_REV01]  97.95,93.33 90 top
IC201  LM1085IS-5.0/NOPB  [IC_SMD_TO-263-3_(KTT0003B)_R_TI_REV01]  148.75,48.25 270 top
IC202  MURATA_NCS6S1205C  [IC_TH_32,00MMX20,00MMX10,00MM_(7-PIN)_R_MURATA_REV01]  147.64,70.73 270 top
IC301  LM1085IS-5.0/NOPB  [IC_SMD_TO-263-3_(KTT0003B)_R_TI_REV01]  21.91,49.04 270 top
IC302  RS-2405D/H2  [IC_TH_SIP8_R_RECOM_REV01]  28.4,71.11 270 top
IC401  ADR3425ARJZ  [IC_SMD_SOT23-6_(MO-178-AB)_R_AD_REV01]  99.38,16.18 270 top
IC402  STM32F429IIT6  [IC_SMD_LQFP176_R_ST_REV01]  103.82,40.78 90 top
IC501  STM32F429VIT6  [IC_SMD_LQFP100_R_ST_REV01]  22.54,29.35 90 top
IC601  ADUM1401ARW  [IC_SMD_SOIC-16_(JEDEC_MS-013-AA)_R_ANALOG_REV01]  40.88,56.02 270 top
IC701  UA78L05ACPK  [IC_SMD_SOT-89_(SC-62/TO-243)_(R-PSSO-F3)_R_TI_REV01]  139.06,95.08 0 top
IC702  ADUM1301ARW  [IC_SMD_SOIC-16_(JEDEC_MS-013-AA)_R_ANALOG_REV01]  131.44,74.6 90 top
IC801  KA7805ERTF  [IC_SMD_TO-252_(D-PAK)_R_FAIRCHILD_REV01]  127,96.82 270 top
IC802  TJA1052IT/1Y  [IC_SMD_SO16_(SOT162-1)_R_NXP_REV01]  119.06,86.34 0 top
IC803  CPC1008N  [K_SMD_SOP-4_R_IXYS_REV01]  126.84,85.08 0 top
IC901  LM317MBSTT3G  [IC_SMD_SOT-223_(TO-261)_(CASE318E-04)_R_REV01]  46.67,82.53 180 top
IC902  CPC1008N  [K_SMD_SOP-4_R_IXYS_REV01]  49.05,65.07 180 top
IC903  CPC1008N  [K_SMD_SOP-4_R_IXYS_REV01]  41.27,73.49 90 top
IC904  CPC1008N  [K_SMD_SOP-4_R_IXYS_REV01]  53.5,65.07 0 top
IC905  CPC1008N  [K_SMD_SOP-4_R_IXYS_REV01]  41.27,69.04 270 top
IC1001  AQV252G2S  [K_SMD_SOP-6_R_PANASONIC_REV01]  59.05,70.63 90 top
IC1002  AQV252G2S  [K_SMD_SOP-6_R_PANASONIC_REV01]  83.82,77.77 90 top
IC1003  AQV252G2S  [K_SMD_SOP-6_R_PANASONIC_REV01]  59.05,77.77 90 top
IC1004  AQV252G2S  [K_SMD_SOP-6_R_PANASONIC_REV01]  83.82,70.47 90 top
IC1005  AQV252G2S  [K_SMD_SOP-6_R_PANASONIC_REV01]  64.45,85.39 0 top
IC1006  AQV252G2S  [K_SMD_SOP-6_R_PANASONIC_REV01]  89.22,85.39 0 top
IC1101  UA78L05ACPK  [IC_SMD_SOT-89_(SC-62/TO-243)_(R-PSSO-F3)_R_TI_REV01]  102.71,96.03 0 top
IC1102  ADUM1300ARW  [IC_SMD_SOIC-16_(JEDEC_MS-013-AA)_R_ANALOG_REV01]  70.17,73.96 90 top
IC1103  ADUM1300ARW  [IC_SMD_SOIC-16_(JEDEC_MS-013-AA)_R_ANALOG_REV01]  94.93,73.96 90 top
IC1401  IP4220CZ6  [D_SMD_TSOP6_(SOT457/SC-74)_R_NXP_REV01]  116.68,107.78 270 top
IC1402  FT231XS-R  [IC_SMD_SSOP-20_R_FTDI_REV01]  109.7,98.09 0 top
IC1403  ADUM1401ARW  [IC_SMD_SOIC-16_(JEDEC_MS-013-AA)_R_ANALOG_REV01]  110.49,72.85 270 top
IC1404  IP4220CZ6  [D_SMD_TSOP6_(SOT457/SC-74)_R_NXP_REV01]  7.78,107.62 0 top
IC1405  FT231XS-R  [IC_SMD_SSOP-20_R_FTDI_REV01]  9.68,85.55 0 top
IC1406  ADUM1401ARW  [IC_SMD_SOIC-16_(JEDEC_MS-013-AA)_R_ANALOG_REV01]  7.62,70.79 180 top
IC1501  AT25128B-SSHL-T  [IC_SMD_SOIC-8_R_ATMEL_REV01]  82.71,12.37 270 top
IC1801  IS42S16400J-5TL  [IC_SMD_TSOP-II_(54-PIN)_R_ISSI_REV01]  137,34.75 0 top
JP2201  [2X12]  90,4 0 bottom
JP2202  [2X12]  135,4 0 bottom
L401  [0805]  114.3,15.22 180 top
L801  B82789C0513H001  [L_SMD_FILTER_HF_R_EPCOS_SIMDAD_1812_REV01]  128.75,105.55 90 top
LED201  Orange  [CHIP-LED0603]  62.5,48.09 90 top
LED301  Orange  [CHIP-LED0603]  62.5,21.58 270 top
LED401  Red  [CHIP-LED0603]  62.5,46.5 90 top
LED402  Green  [CHIP-LED0603]  62.5,44.91 90 top
LED501  Red  [CHIP-LED0603]  62.5,19.99 270 top
LED502  Green  [CHIP-LED0603]  62.5,18.4 270 top
Q401  7B-8.000MAAJ-T  [G_SMD_5,00MM_X_3,20MM_0,90MM_(7B)_TXC_REV01]  107,16.34 0 top
Q402  [MS3V-T1R]  92.23,21.89 0 top
Q501  7B-8.000MAAJ-T  [G_SMD_5,00MM_X_3,20MM_0,90MM_(7B)_TXC_REV01]  35.24,32.53 90 top
R201  130  [R0603]  59.37,48.09 0 top
R301  130  [R0603]  65.56,21.58 0 top
R401  10k  [R0603]  83.5,33.96 90 top
R402  10k  [R0603]  75.72,51.1 90 top
R403  0  [R0603]  54.93,43.17 0 top
R404  680  [R0603]  54.93,41.58 180 top
R405  10k  [R0603]  55.88,32.69 270 top
R406  0  [R0603]  52.39,38.88 90 top
R407  10k  [R0603]  122.08,31.89 90 top
R408  130  [R0603]  59.37,46.5 0 top
R409  130  [R0603]  59.37,44.91 0 top
R501  0  [R0603]  37.78,41.89 90 top
R502  10k  [R0603]  25.56,19.03 90 top
R503  680  [R0603]  37.78,38.88 90 top
R504  10k  [R0603]  37.15,18.4 90 top
R505  10k  [R0603]  30.32,15.38 180 top
R506  0  [R0603]  54.93,8.24 270 top
R507  10k  [R0603]  22.23,38.72 0 top
R508  130  [R0603]  65.56,19.99 180 top
R509  130  [R0603]  65.56,18.4 180 top
R701  1.5k  [R0603]  138.43,105.55 90 top
R702  1.5k  [R0603]  140.02,105.55 90 top
R703  680  [R0603]  137.64,103.17 0 top
R704  680  [R0603]  140.81,103.17 180 top
R705  0  [R0603]  143.35,102.38 90 top
R706  10  [R0603]  133.83,106.66 90 top
R707  10k  [R0603]  135.57,106.66 270 top
R708  10k  [R0603]  122.4,71.9 0 top
R709  10k  [R0603]  122.4,73.96 0 top
R710  10k  [R0603]  122.4,76.03 0 top
R801  62  [0603]  124.78,103.81 180 top
R802  62  [0603]  124.78,105.24 0 top
R803  10k  [0603]  125.57,90.47 270 top
R804  430  [0603]  121.92,78.25 180 top
R805  10k  [0603]  120.49,65.87 0 top
R806  10  [0603]  120.49,64.28 0 top
R901  10  [R0603]  45.24,91.58 0 top
R902  120  [R0603]  47.94,76.03 90 top
R903  10k  [R0603]  51.12,60.63 180 top
R904  10k  [R0603]  36.99,73.65 90 top
R905  10  [R0603]  55.88,103.33 180 top
R906  330  [R0603]  50.16,90 90 top
R907  430  [R0603]  56.83,61.26 180 top
R908  10k  [R0603]  54.45,58.56 90 top
R909  10  [R0603]  56.83,56.18 0 top
R910  430  [R0603]  38.42,65.55 90 top
R911  10k  [R0603]  36.04,68.41 180 top
R912  10  [R0603]  36.04,70.15 180 top
R1001  10  [R0603]  61.75,56.18 0 top
R1002  10  [R0603]  76.52,56.18 0 top
R1003  10k  [R0603]  59.37,58.56 270 top
R1004  10k  [R0603]  74.14,58.56 270 top
R1005  430  [R0603]  61.75,61.26 180 top
R1006  430  [R0603]  76.52,61.26 180 top
R1007  10  [R0603]  66.67,56.18 0 top
R1008  10  [R0603]  81.44,56.18 0 top
R1009  10k  [R0603]  64.29,58.56 270 top
R1010  10k  [R0603]  79.06,58.56 270 top
R1011  430  [R0603]  66.67,61.26 180 top
R1012  430  [R0603]  81.44,61.26 180 top
R1013  10  [R0603]  71.6,56.18 0 top
R1014  10  [R0603]  86.36,56.18 0 top
R1015  10k  [R0603]  69.22,58.56 270 top
R1016  10k  [R0603]  83.98,58.56 270 top
R1017  430  [R0603]  71.6,61.26 180 top
R1018  430  [R0603]  86.36,61.26 0 top
R1101  47  [R0603]  59.69,110.16 270 top
R1102  47  [R0603]  70.17,110.16 270 top
R1103  47  [R0603]  80.64,110.16 270 top
R1104  47  [R0603]  91.12,110.16 90 top
R1105  47  [R0603]  101.6,110.16 90 top
R1106  47  [R0603]  112,110.16 90 top
R1107  10k  [R0603]  77.15,71.42 270 top
R1108  10k  [R0603]  101.92,71.42 270 top
R1109  10k  [R0603]  74.3,83.65 180 top
R1110  10k  [R0603]  98.9,83.65 180 top
R1111  10k  [R0603]  74.3,81.9 180 top
R1112  10k  [R0603]  98.9,81.9 180 top
R1401  27  [0603]  117.79,104.76 90 top
R1402  27  [0603]  120.09,108.73 180 top
R1403  0  [0603]  115.09,98.09 90 top
R1404  0  [0603]  110.65,92.06 180 top
R1405  27  [0603]  12.06,91.11 90 top
R1406  27  [0603]  13.49,91.11 90 top
R1407  0  [0603]  14.92,84.92 90 top
R1408  0  [0603]  12.06,80.95 180 top
R1501  10k  [0603]  87.79,13 0 top
R1502  10k  [0603]  79.53,8.56 180 top
S401  KMR211GLFS  [S_SMD_4,60MMX2,80MMX1,90MM_R_CK-COMPONENTS_REV01]  54.93,37.77 270 top
S501  KMR211GLFS  [S_SMD_4,60MMX2,80MMX1,90MM_R_CK-COMPONENTS_REV01]  55.72,3.8 270 top
SV501  [MA06-2]  6.99,10 90 top
SV901  [MA04-2]  90,102 0 bottom
SV1601  [MA04-2]  26,102 0 top
SV1602  [MA08-2]  47,39.54 90 top
SV1603  [MA04-2]  36.5,102 0 top
SV1604  [MA08-2]  7,39.54 90 top
SV2101  [MA04-2]  112.5,4 0 bottom
T401  BSS84P  [V_SMD_SOT23_(TO-236AB)_R_INFINEON_REV01]  73.18,51.1 90 top
T501  BSS84P  [V_SMD_SOT23_(TO-236AB)_R_INFINEON_REV01]  34.61,18.4 90 top
T701  IRLML0100TRPBF  [V_SMD_SOT-23_(TO-236AB)_R_IR_REV01]  134.62,110.16 0 top
T801  IRLML0100TRPBF  [V_SMD_SOT-23_(TO-236AB)_R_IR_REV01]  120.49,68.56 0 top
T901  BUK964R8-60E  [V_SMD_TO-263_(D²PAK)_R_NXP_REV01]  62.23,99.05 270 top
T902  IRLML0100TRPBF  [V_SMD_SOT-23_(TO-236AB)_R_IR_REV01]  56.83,58.72 0 top
T903  IRLML0100TRPBF  [V_SMD_SOT-23_(TO-236AB)_R_IR_REV01]  36.04,65.71 180 top
T1001  IRLML0100TRPBF  [V_SMD_SOT-23_(TO-236AB)_R_IR_REV01]  61.75,58.72 0 top
T1002  IRLML0100TRPBF  [V_SMD_SOT-23_(TO-236AB)_R_IR_REV01]  76.52,58.72 0 top
T1003  IRLML0100TRPBF  [V_SMD_SOT-23_(TO-236AB)_R_IR_REV01]  66.67,58.72 0 top
T1004  IRLML0100TRPBF  [V_SMD_SOT-23_(TO-236AB)_R_IR_REV01]  81.44,58.72 0 top
T1005  IRLML0100TRPBF  [V_SMD_SOT-23_(TO-236AB)_R_IR_REV01]  71.6,58.72 0 top
T1006  IRLML0100TRPBF  [V_SMD_SOT-23_(TO-236AB)_R_IR_REV01]  86.36,58.72 0 top
TP_GND_201  [1,6/0,8]  153.59,33.69 0 top
TP_GND_301  [1,6/0,8]  4.65,58.65 270 top
U$2  [ESD_10.00]  71.91,37.61 0 top
X201  43045-0600_MOLEX_6PIN  [X_TH_MOLEX_43045-0600_R_REV01]  151.13,117.46 180 top
X401  [MA03-1]  57.94,51.1 180 top
X402  MA02-1  [MA02-1]  67.47,51.1 0 top
X403  SAMTEC_FTS_20POL_HEADER_VERTIKAL_REV01  [X_SMD_FTS_110-03_(20POL)_R_SAMTEC_REV01]  62.5,35.23 270 top
X501  MA02-1  [MA02-1]  56.2,21.58 270 top
X502  SAMTEC_FTS_20POL_HEADER_VERTIKAL_REV01  [X_SMD_FTS_110-03_(20POL)_R_SAMTEC_REV01]  62.5,10.14 90 top
X701  43045-0400_MOLEX_4PIN  [X_TH_MOLEX_43045-0400_R_REV01]  139.06,117.46 180 top
X801  43045-0400_MOLEX_4PIN  [X_TH_MOLEX_43045-0400_R_REV01]  128.59,117.46 180 top
X901  43045-0200_MOLEX_2PIN  [X_TH_MOLEX_43045-0200_R_REV01]  46.2,117.46 180 top
X902  MA02-1SMALL_PINS_OUTLINE  [MA02-1A]  46.2,69.84 90 top
X1201  43045-0400_MOLEX_4PIN  [X_TH_MOLEX_43045-0400_R_REV01]  55.24,117.46 180 top
X1202  43045-0400_MOLEX_4PIN  [X_TH_MOLEX_43045-0400_R_REV01]  86.68,117.46 180 top
X1203  43045-0400_MOLEX_4PIN  [X_TH_MOLEX_43045-0400_R_REV01]  65.72,117.46 180 top
X1204  43045-0400_MOLEX_4PIN  [X_TH_MOLEX_43045-0400_R_REV01]  97.16,117.46 180 top
X1205  43045-0400_MOLEX_4PIN  [X_TH_MOLEX_43045-0400_R_REV01]  76.2,117.46 180 top
X1206  43045-0400_MOLEX_4PIN  [X_TH_MOLEX_43045-0400_R_REV01]  107.63,117.46 180 top
X1401  MINI-USB-2.0  [X_SMD_MINI-USB-2.0-TYPAB_R_MULTICOMP_REV01]  118.11,116.35 180 top
X1402  MINI-USB-2.0  [X_SMD_MINI-USB-2.0-TYPAB_R_MULTICOMP_REV01]  7.5,116.39 180 top
X1601  43045-1600_MOLEX_16PIN  [X_TH_MOLEX_43045-1600_R_REV01]  28,117.46 180 top

## Tracks (layer width: path | path; a pad name or v marks a point on that pad's centre or on a via)
+3.3V_0  (via drill 0.3)
  Top 0.152: v86.52,37.93 87.53,37.93 C421.1 88.37,38.03 88.92,38.58 IC402.159 | v120.49,31.26 120.23,31.36 C405.1 118.64,31.36 117.97,32.03 IC402.49 | v123.19,37.93 122.77,38.3 C412.1 121.84,38.53 IC402.62 | 119.67,48.53 C406.1 119.35,48.53 IC402.82 | v120.81,48.4 119.8,48.4 | v107,57.45 107.1,57.19 C416.1 107.1,55.6 107.57,55.13 IC402.103 | v102.55,57.45 102.55,56.44 | v105.09,24.59 104.88,24.81 C410.1 103.98,24.91 103.82,25.07 103.82,26.97 104.07,27.22 IC402.23 | v111.86,23.58 C401.1 109.91,23.58 109.7,23.8 109.7,26.02 110.57,26.9 IC402.36 | v99.22,25.54 100.27,25.54 C409.1 100.07,25.86 IC402.15 | 88.47,50.37 C419.1 | C417.1 102.07,56.23 IC402.114 | C419.1 88.8,50.03 IC402.136 | L401.1 114.99,15.29 C404.1 115.2,13.75 v115.2,12.79 | v100.33,11.26 100.33,12.47 C403.1 C408.1 100.39,15.04 IC401.4 IC401.3 | v82.87,15.86 C1501.2 84.2,15.65 84.2,14.53 84.45,14.27 IC1501.8 | R1501.2 v90.65,13 | v78.74,7.29 78.74,8.55 R1502.2 | v120.02,44.36 120.02,43.38 C413.1 119.59,43.53 IC402.72 | v115.73,56.82 115.63,56.72 C415.1 113.88,56.72 113.74,56.58 113.74,55.31 113.57,55.14 IC402.91 | 95.57,56.92 C418.1 | 95.57,56.91 C418.1 | v86.52,41.74 86.58,41.68 C420.1 87.69,41.74 88.74,41.74 88.9,41.89 88.9,42.85 89.38,43.32 90.01,43.32 90.22,43.53 IC402.149 | v87.15,31.1 88.74,31.1 89.06,31.42 89.06,32.31 C407.1 | 89.28,32.53 C407.1 | LED201.A v64.29,48.09 | v55.88,30.62 R405.2 | v118.27,77.45 118.21,77.51 C1405.1 116.94,77.3 IC1403.16 | 75.63,52.04 R402.2 | R402.2 76.94,51.95 v76.99,51.9 | C418.1 94.24,56.76 v94.14,56.66 | 88.22,50.21 C419.1 | v87.31,49.99 87.47,50.15 88.16,50.15 C419.1 | C601.2 47.25,60.47 IC601.16 44.13,60.47 43.97,60.31 43.97,53.01 44.13,52.85 IC601.10
  Top 0.152: T401.2 75.57,52.1 R402.2 | IC1403.10 v117.63,69.68 | IC1801.49 130.55,40.37 C1807.1 130.89,43.03 v130.89,43.8 | IC1801.43 135.4,42.92 C1806.1 135.25,43.58 v135.25,44.44 | IC1801.27 147.4,31.97 147.9,32.47 C1804.1 150.28,32.47 v150.34,32.53 | v136.21,26.18 136.21,25.33 C1803.1 136.84,25.07 137,25.23 IC1801.14 | IC1801.9 133,27.74 C1802.1 133.45,26.23 v133.51,26.18 | IC1801.3 128.2,27.62 C1801.1 128.53,26.23 v128.59,26.18 | IC1801.1 126.54,29.25 C1805.1 v124.78,30.47 | X403.1 61.44,40.94 | IC402.171 89.28,32.53 C407.1 | C418.1 95.25,55.39 95.57,55.07 IC402.127 | IC402.172 89.45,32.03 C407.1 | IC802.1
  Top 0.203: 119.8,48.4 C406.1 | 102.55,56.44 C417.1 | IC1005.1 62.88,82.39 v62.87,82.38 | IC1003.1 62.05,76.2 v61.91,76.34 | IC1001.1 62.05,69.06 v61.91,69.2 | IC1006.1 87.65,82.39 v87.79,82.53 | v65.09,66.66 65.19,66.76 C1106.1 65.57,68.31 | v89.85,66.66 89.85,67.83 C1107.1 89.95,69.52 | v60.33,42.69 C430.1 61.75,42.63 61.75,41.26 61.44,40.94 | v113.51,80 C807.2 IC802.1 | v127.64,66.5 127.64,67.51 C707.1 127.53,70.1 | v48.58,60.63 47.31,60.63 47.15,60.95 47.47,60.84 C601.2 | IC1004.1 86.68,67.61 v86.68,68.88 | IC1002.1 86.68,75.23 v86.68,76.19 | v125.25,77.77 IC702.10 | IC803.1 126.21,82.28 v126.36,82.22 | IC902.4 51.22,62.27 v51.28,62.22 | IC904.1 53.12,62.27 v53.18,62.22
  Top 0.254: IC1103.10 v92.08,77.14 | IC1103.16 89.95,69.52 | IC1102.10 v67.31,77.14 | 65.57,68.31 65.57,69.44 IC1102.16
  Top 0.406: C1601.1 50.32,32.05 49.85,32.53 48.93,32.53 SV1602.3 | IC702.16 127.53,70.15 127.53,70.1
  Top 0.61: 118.43,7.03 C2101.2 118.43,7.19 v118.43,5.22
  Bottom 0.61: SV2101.1 118,2.73 118.43,3.16 v118.43,5.22
  other vias: 156.21,38.56 155.26,38.56 154.31,38.56 153.35,38.56 152.4,38.56 156.21,37.61 155.26,37.61 154.31,37.61 153.35,37.61 152.4,37.61
  pour Route3 (no thermals): 73.82,1.12 73.82,20.6 arc-90 74.32,21.1 81.42,21.1 arc90 81.92,21.6 81.92,28.38 arc90 81.42,28.88 44.31,28.88 arc-90 43.81,29.38 43.81,62.35 arc-90 44.31,62.85 60.78,62.85 arc90 61.28,63.35 61.28,82.67 arc-90 61.78,83.17 67.13,83.17 arc-90 67.63,82.67 67.63,63.35 arc90 68.13,62.85 85.54,62.85 arc90 86.04,63.35 86.04,83.17 91.89,83.17 arc-90 92.39,82.67 92.39,63.35 arc90 92.89,62.85 112.21,62.85 arc90 112.71,63.35 112.71,82.35 arc-90 113.21,82.85 128.09,82.85 arc-90 128.59,82.35 128.59,65.57 arc90 129.09,65.07 157.3,65.07 arc-90 157.8,64.57 157.8,29.38 arc-90 157.3,28.88 149.72,28.88 arc90 149.22,28.38 149.22,21.76 arc90 149.72,21.26 157.3,21.26 arc-90 157.8,20.76 157.8,1.12 arc-90 157.29,0.62 74.32,0.62 arc-90
  pour Top (no thermals): 146.21,53.96 156.84,53.96 156.84,37.13 151.92,37.13 151.92,42.85 143.99,42.85 143.99,46.97 140.97,46.97 140.97,49.2 146.21,49.2
+3.3V_1  (via drill 0.3)
  Top 0.152: v14.92,19.83 14.92,20.84 | 14.79,20.97 14.76,20.94 14.76,23.35 IC501.75 | C506.1 29.47,40.52 v29.53,40.47 | C503.1 15.3,38.35 v15.24,38.4 | C502.1 32.12,33.32 32.07,33.32 C502.1 | C502.1 30.29,33.38 IC501.21 | C502.1 31.59,33.85 IC501.22 | C502.1 31.04,32.35 IC501.19 | C502.1 v32.07,34.43 | v60.8,21.58 LED301.A | v29.37,18.88 29.43,18.93 C508.1 28.57,20.84 28.57,21.58 IC501.100 | v28.42,15.38 R505.2 | v35.88,63.48 35.82,63.43 C602.1 35.82,60.54 35.89,60.47 IC601.1 | 37.06,19.34 R504.2 | 28.36,40.47 27.78,40.47 27.54,40.23 IC501.28 | IC601.7 37.62,52.85 37.78,52.69 37.78,50.94 v37.47,50.63 | IC1406.16 12.06,64.34 | IC501.6 31.76,25.85 33.66,23.96 34.92,23.96 35.24,24.27 C510.1 35.19,25.15 v34.13,25.15 | IC501.11 32.49,28.35 C504.1 | IC501.50 15.48,37.1 | 63.4,4.34 63.48,4.43 X502.1
  Top 0.203: 14.92,20.84 C507.1 14.79,20.97 | 32.97,28.35 C504.1 33.87,27.98 v33.97,28.08 | 15.48,37.1 C503.1 | 28.36,40.47 C506.1 | 63.4,4.34 C513.1 v64.77,2.53 | 29.5,20.06 C508.1 | 12.06,64.34 C1410.1 12.38,64.02 v12.38,62.85 | v33.5,19.59 33.69,19.4 T501.2 37,19.4 R504.2 | v38.42,73.17 38.42,72.27 arc90 IC903.4 | v38.42,69.36 38.42,70.25 arc-90 IC905.1 | IC1406.10 v4.45,64.44
  Top 0.406: 10.45,33.13 C1603.1
  Top 0.61: SV1604.3 10.39,33.19 C1603.1
  other vias: 30.32,57.45 31.27,57.45 31.27,56.5 30.32,56.5 29.37,57.45 29.37,56.5
  pour Route3 (no thermals): 55.27,24.43 68.87,24.43 arc-90 69.37,23.93 69.37,1.12 arc-91 68.87,0.62 2.72,0.62 arc-90 2.22,1.12 2.22,66.48 arc-90 2.72,66.98 12.84,66.98 arc-90 13.34,66.48 13.34,59.22 arc90 13.84,58.72 30.46,58.72 arc90 30.96,59.22 30.96,66.48 arc-90 31.46,66.98 33.47,66.98 arc90 33.97,67.48 33.97,74.89 arc-90 34.47,75.39 38.55,75.39 arc-90 39.05,74.89 39.05,17.63 arc90 39.55,17.13 54.27,17.13 arc90 54.77,17.63 54.77,23.93 arc-90
  pour Top (no thermals): 19.05,57.77 31.59,57.77 31.59,43.96 19.05,43.96 19.05,47.93 14.29,47.93 14.29,50.15 19.05,50.15
+5.0V_0  (via drill 0.3)
  Top 0.406: v54.13,29.51 51.44,29.51 51.28,29.67 51.28,30.57 C1602.1 51.06,30.78 50.16,30.78 49.05,31.89 47.03,31.89 SV1602.4
  Top 0.61: SV2101.2 116.31,7.24 C2102.1
  Top 0.813: IC201.3 140.18,45.7 139.7,46.18 C202.1 138.33,48.67 137.32,49.67 137.32,57.77 136.68,58.41 134.46,58.41 133.99,58.88 C208.1 C207.1 136.42,60.79 153.67,60.79 155.16,59.3 IC202.14
  Route3 0.406: 118.59,0.78 157.14,0.78 arc90 157.64,1.28 157.64,20.6 arc90 157.14,21.1 149.57,21.1 arc-90 149.07,21.6 149.07,28.54 arc-90 149.57,29.04 157.14,29.04 arc90 157.64,29.54 157.64,57.29 IC202.14 | 118.59,0.78 74.48,0.78 arc-90 73.98,1.28 73.98,20.44 arc-90 74.48,20.94 81.73,20.94 arc90 82.23,21.44 82.23,28.54 arc90 81.73,29.04 54.13,29.04 v54.13,29.51 | SV2101.2 116.95,5.27 118.59,3.32 118.59,0.78
+5.0V_1
  Top 0.406: SV1604.4 5.7,33.22 C1604.1 3.65,52.53 4.6,53.33 C301.1
  Top 1.016: IC302.6 24.92,67.3 23.97,66.34 23.97,58.72 23.23,57.98 13.87,57.98 13.28,57.4 C307.1 C308.1 C301.1 13.28,46.87 13.65,46.5 IC301.3
ADC_MCU_0_CH_0  (via drill 0.3)
  Top 0.152: IC402.54 115.47,34.53 v115.41,34.59
  Bottom 0.152: v115.41,34.59 115.41,31.42 116.05,30.78 117.63,30.78 117.95,30.47 117.95,29.19 117,28.24 117,11.1 118.11,9.99 139.22,9.99 141.45,7.76 141.45,5.37 JP2202.8
ADC_MCU_0_CH_1  (via drill 0.3)
  Top 0.152: IC402.55 117.51,35.03 v117.79,34.75
  Bottom 0.152: v117.79,34.75 117.79,31.26 118.27,30.78 118.27,29.04 117.32,28.08 117.32,11.42 118.27,10.46 140.81,10.46 142.72,8.56 142.72,4.1 JP2202.7
ADC_MCU_0_CH_2  (via drill 0.3)
  Top 0.152: IC402.56 118.28,35.53 v118.43,35.39
  Bottom 0.152: v118.43,35.39 118.43,31.1 118.59,30.94 118.59,28.88 117.63,27.92 117.63,11.73 118.43,10.94 142.08,10.94 143.99,9.03 143.99,5.37 JP2202.6
ADC_MCU_0_CH_3  (via drill 0.3)
  Top 0.152: v119.06,34.75 119.06,35.7 118.73,36.03 IC402.57
  Bottom 0.152: v119.06,34.75 118.9,34.59 118.9,28.72 117.95,27.77 117.95,12.05 118.59,11.42 143.51,11.42 145.26,9.67 145.26,4.1 JP2202.5
ADC_MCU_0_CH_4  (via drill 0.3)
  Top 0.152: JP2202.9 138.81,2.75 140.02,3.95 140.02,7.92 137,10.94 115.89,10.94 114.94,11.89 v113.82,11.89 | IC402.41 113.07,26.93 v113.19,26.81
  Bottom 0.152: v113.19,26.81 113.67,26.34 113.67,23.8 114.14,23.32 114.14,12.21 v113.82,11.89
BENDER_ADUM_SUPPLY
  Top 0.203: C706.1 134.54,80.49 134.54,77.85 134.62,77.77 IC702.7 | C706.1 133.99,80.53 133.99,70.47 134.3,70.15 IC702.1 | C706.1 134.3,81.05 134.3,81.74 135.25,82.69 135.25,90.63 135.79,91.16 C703.1 137.57,91.57 IC701.1
BENDER_NEGATIVE_SUPPLY
  Top 0.152: 137.56,113.14 X701.1
  Top 0.254: 137.56,113.14 135.22,113.14 134.62,112.54 T701.3
  Top 0.406: T701.3 134.67,111.16
BENDER_OK  (via drill 0.3)
  Top 0.152: R708.2 123.25,67.24 v123.35,67.14 | v112.71,31.1 113.28,30.53 IC402.46
  Top 0.203: R708.2 124.04,72.69 IC702.14
  Bottom 0.152: v123.35,67.14 123.35,61.58 123.19,61.42 119.54,61.42 116.52,58.41 116.52,54.12 114.3,51.9 114.3,48.88 113.67,48.25 113.67,47.13 112.39,45.86 112.39,42.05 113.03,41.42 113.03,40.62 112.39,39.99 112.39,31.42 v112.71,31.1
BENDER_OK_EXT
  Top 0.152: 137.56,110.14 X701.3
  Top 0.203: R701.2 138.43,109.28 137.56,110.14
BENDER_PWM  (via drill 0.3)
  Top 0.152: v113.35,31.89 114.21,31.03 IC402.47
  Top 0.203: R709.2 v124.62,73.96 IC702.13
  Bottom 0.152: v124.62,73.96 123.98,73.33 123.98,61.74 123.35,61.1 119.7,61.1 116.84,58.25 116.84,53.96 114.62,51.74 114.62,48.72 113.98,48.09 113.98,46.97 112.71,45.7 112.71,42.21 113.35,41.58 113.35,40.47 112.71,39.83 112.71,32.53 v113.35,31.89
BENDER_PWM_EXT
  Top 0.152: X701.4 140.56,110.14
  Top 0.203: R702.2 140.02,109.59 140.56,110.14
BENDER_SUPPLY_ENABLE  (via drill 0.3)
  Top 0.152: v113.35,29.51 114.07,28.79 IC402.43 | v113.35,42.37 v112.39,41.1
  Top 0.203: R710.2 v124.62,76.03 125.41,75.23 IC702.12
  Bottom 0.152: v124.62,76.03 125.57,75.07 125.57,70.95 124.62,69.99 124.62,61.74 123.67,60.79 119.86,60.79 117.16,58.09 117.16,53.8 114.94,51.58 114.94,48.56 114.3,47.93 114.3,46.82 113.35,45.86 v113.35,42.37 | v112.39,41.1 112.08,40.78 112.08,30.78 v113.35,29.51
BMS-INTERFACE_0_GPIO_0  (via drill 0.3)
  Top 0.152: v95.73,49.99 97.16,49.99 98.57,51.41 IC402.121 | v82.07,49.67 81.44,49.04 51.44,49.04 51.12,48.72 51.12,43.8 50.67,43.35 SV1602.11
  Bottom 0.152: v95.73,49.99 95.57,49.99 94.61,50.94 83.34,50.94 v82.07,49.67
BMS-INTERFACE_0_GPIO_1  (via drill 0.3)
  Top 0.152: v96.36,50.63 97.16,50.63 98.07,51.54 IC402.122 | v82.07,50.63 80.8,49.36 51.28,49.36 50.8,48.88 50.8,44.91 50.48,44.59 46.97,44.59 SV1602.12
  Bottom 0.152: v96.36,50.63 95.41,50.63 94.77,51.26 82.71,51.26 v82.07,50.63
BMS-INTERFACE_0_GPIO_2  (via drill 0.3)
  Top 0.152: v94.3,50.31 95.25,51.26 97.16,51.26 97.57,51.68 IC402.123
  Bottom 0.152: SV1602.2 45.73,31.59 46.04,31.89 50.16,31.89 50.96,32.69 67.63,32.69 69.06,31.26 82.07,31.26 82.71,31.89 82.71,49.83 83.5,50.63 93.34,50.63 93.66,50.31 v94.3,50.31
BMS-INTERFACE_0_GPIO_3  (via drill 0.3)
  Top 0.152: v84.93,35.7 84.93,36.5 85.25,36.81 88.9,36.81 89.12,37.03 IC402.162
  Bottom 0.152: SV1602.1 49.87,30.65 50.64,31.42 68.26,31.42 68.74,30.94 83.66,30.94 84.14,31.42 84.14,35.07 v84.93,35.7
BMS-INTERFACE_0_SPI_CS  (via drill 0.3)
  Top 0.152: v69.37,32.05 69.37,31.42 69.69,31.1 83.98,31.1 84.45,30.62 84.45,29.04 84.93,28.56 92.39,28.56 92.71,28.88 96.68,28.88 100.33,32.53 IC402.50 | v50.32,33.64 50.32,36.5 49.85,36.97 47.03,36.97 SV1602.8
  Bottom 0.152: v69.37,32.05 68.42,33 50.96,33 v50.32,33.64
BMS-INTERFACE_0_SPI_MISO  (via drill 0.3)
  Top 0.152: v69.37,33.96 70.17,33.96 70.48,33.64 70.48,32.05 70.8,31.73 84.61,31.73 85.09,31.26 85.09,29.67 85.57,29.19 92.08,29.19 92.39,29.51 96.36,29.51 100.01,33.16 115.09,33.16 115.41,33.48 116.52,33.48 IC402.52
  Bottom 0.152: v69.37,33.96 69.06,33.64 53.18,33.64 52.39,34.43 47.03,34.43 SV1602.6
BMS-INTERFACE_0_SPI_MOSI  (via drill 0.3)
  Top 0.152: v69.37,34.91 70.33,34.91 70.8,34.43 70.8,32.37 71.12,32.05 84.93,32.05 85.41,31.58 85.41,29.99 85.88,29.51 91.92,29.51 92.23,29.83 96.2,29.83 99.85,33.48 114.94,33.48 115.49,34.04 IC402.53
  Bottom 0.152: v69.37,34.91 68.42,33.96 53.82,33.96 52.04,35.73 SV1602.5
BMS-INTERFACE_0_SPI_SCK  (via drill 0.3)
  Top 0.152: v69.37,33 69.85,33 70.17,32.69 70.17,31.73 70.48,31.42 84.3,31.42 84.77,30.94 84.77,29.35 85.25,28.88 92.23,28.88 92.55,29.19 96.52,29.19 100.17,32.85 115.25,32.85 115.41,33 116.54,33 IC402.51 | 51.59,33.48 v51.59,33.64 50.96,34.28 50.96,37.29 50.01,38.24 48.3,38.24 SV1602.7
  Bottom 0.152: v69.37,33 69.06,33.32 51.91,33.32 v51.59,33.64
BMS-INTERFACE_1_GPIO_0  (via drill 0.3)
  Top 0.152: v11.75,30.47 13.34,30.47 13.65,30.15 13.65,26.5 13.79,26.35 IC501.69
  Bottom 0.152: v11.75,30.47 11.27,30.47 10.95,30.78 10.95,39.2 10,40.15 10,42.85 9.5,43.35 SV1604.11
BMS-INTERFACE_1_GPIO_1  (via drill 0.3)
  Top 0.152: v12.54,29.83 13.02,29.83 13.34,29.51 13.34,26.02 13.5,25.85 IC501.70
  Bottom 0.152: SV1604.12 6.64,43.35 6.99,43.01 6.99,42.53 7.46,42.05 9.37,42.05 9.68,41.74 9.68,39.99 10.64,39.04 10.64,30.15 10.95,29.83 v12.54,29.83
BMS-INTERFACE_1_GPIO_2
  Top 0.152: SV1604.2 5.71,30.64 5.71,29.67 6.03,29.35 12.06,29.35 12.86,28.56 12.86,25.54 13.05,25.35 IC501.71
BMS-INTERFACE_1_GPIO_3  (via drill 0.3)
  Top 0.152: v22.86,23 23.34,23 23.54,22.8 IC501.90 | v18.41,23 16.83,23 16.51,23.32 v16.51,25.07
  Bottom 0.152: v22.86,23 v18.41,23 | SV1604.1 8.23,30.65 9.68,29.19 16.19,29.19 16.51,28.88 v16.51,25.07
BMS-INTERFACE_1_SPI_CS
  Top 0.152: SV1604.8 6.97,39.51 9.84,39.51 11.75,41.42 24.61,41.42 27.04,38.98 IC501.29
BMS-INTERFACE_1_SPI_MISO
  Top 0.152: SV1604.6 6.97,36.97 10.32,36.97 10.64,37.29 10.64,39.04 12.38,40.78 24.29,40.78 26.04,39.03 IC501.31
BMS-INTERFACE_1_SPI_MOSI
  Top 0.152: SV1604.5 10.82,35.73 11.11,36.02 11.11,38.88 12.7,40.47 24.13,40.47 25.54,39.05 IC501.32
BMS-INTERFACE_1_SPI_SCK
  Top 0.152: SV1604.7 9.87,38.27 10.16,38.56 10.16,39.2 12.06,41.1 24.45,41.1 26.54,39.01 IC501.30
BOOT_0_MCU_0  (via drill 0.3)
  Top 0.152: v71.28,35.55 71.79,35.03 83.5,35.03 R401.2 83.73,35.03 IC402.166 | T401.3 X402.2 | X402.2
  Bottom 0.152: v71.28,35.55 71.28,50.63 70.8,51.1 X402.2
BOOT_0_MCU_1  (via drill 0.3)
  Top 0.152: X501.2 56.2,17.45 55.24,16.5 33.97,16.5 v33.34,17.13 33.34,18.29 T501.3 | v25.72,23.16 25.54,22.99 IC501.94 25.54,21.58 25.54,19.9 R502.2 25.54,20.06
  Bottom 0.152: v25.72,23.16 28.42,23.16 30.48,21.1 30.48,17.92 31.27,17.13 v33.34,17.13
CAN_0_H
  Top 0.152: 129.9,109.95 X801.4
  Top 0.203: L801.3 129.9,109.95 130.09,110.14 129.12,111.11 128.48,111.11 D801.2
CAN_0_L
  Top 0.152: 127.09,109.98 X801.3
  Top 0.203: 127.09,109.98 127.6,109.63 L801.4 | D801.1 126.33,109.21 X801.3
CAN_0_MCU_1_RX  (via drill 0.3)
  Top 0.152: IC501.91 24.04,18.17 v24.13,18.08
  Bottom 0.152: SV501.4 6.97,7.45 9.53,7.45 11.43,9.35 11.43,15.7 11.75,16.02 22.07,16.02 v24.13,18.08
CAN_0_MCU_1_TX  (via drill 0.3)
  Top 0.152: 16.3,34.85 v16.35,34.75 16.25,34.85 IC501.52
  Bottom 0.152: SV501.3 8.26,6.18 6.99,4.91 3.81,4.91 3.49,5.22 3.49,17.77 5.08,19.51 12.06,19.51 12.38,19.83 12.38,22.37 13.02,23 16.83,23 17.14,23.32 17.14,33.96 v16.35,34.75
CAN_0_RX  (via drill 0.3)
  Top 0.152: v120.02,76.98 120.02,79.84 119.7,80.15 IC802.5 | v110.33,49.36 103.19,49.36 v102.71,48.88 | v102.71,37.45 101.8,36.53 IC402.163
  Bottom 0.152: v120.02,76.98 120.02,64.44 119.7,64.12 118.43,64.12 118.11,63.8 118.11,61.1 117.16,60.15 114.3,60.15 113.82,59.67 113.82,53.01 113.51,52.69 111.12,52.69 110.33,51.9 v110.33,49.36 | v102.71,48.88 v102.71,37.45
CAN_0_TRANS_STANDBY_CONTROL  (via drill 0.3)
  Top 0.152: v110.97,48.72 110.97,47.93 110.57,47.53 IC402.141 | v118.9,63.17 121.12,63.17 121.28,63.33 R806.2
  Bottom 0.152: v110.97,48.72 110.97,51.9 111.44,52.37 113.82,52.37 114.14,52.69 114.14,59.36 114.62,59.83 117.32,59.83 118.43,60.95 118.43,62.69 v118.9,63.17
CAN_0_TX  (via drill 0.3)
  Top 0.152: v119.38,77.77 119.38,79.84 119.06,80.15 117.47,80.15 117.16,80.47 IC802.3 | IC402.93 v112.57,56.99
  Bottom 0.152: v119.38,77.77 119.38,64.91 119.06,64.6 118.27,64.6 117.63,63.96 117.63,61.1 117,60.47 113.19,60.47 112.55,59.83 v112.57,56.99
CAN_1_RX  (via drill 0.3)
  Top 0.152: v95.25,34.75 95.09,34.91 94.3,34.91 93.92,34.53 IC402.167
  Bottom 0.152: v95.25,34.75 95.25,30.78 93.66,29.19 93.66,8.24 94.77,7.13 98.11,7.13 98.9,6.33 98.9,5.28 JP2201.6
CAN_1_TRANS_STANDBY_CONTROL  (via drill 0.3)
  Top 0.152: IC402.165 95.74,35.53 v96.04,35.23
  Bottom 0.152: v96.04,35.23 96.04,31.1 93.98,29.04 93.98,8.56 94.93,7.61 99.22,7.61 100.17,6.65 100.17,4.01 JP2201.5
CAN_1_TX  (via drill 0.3)
  Top 0.152: IC402.168 94.22,34.03 v94.46,34.28
  Bottom 0.152: v94.46,34.28 94.61,34.12 94.61,30.62 93.34,29.35 93.34,7.76 95.09,6.02 95.09,3.99 JP2201.7
CAN_L_INT  (via drill 0.3)
  Top 0.203: v120.17,89.36 119.7,89.84 IC802.12 | R801.1 127.6,103.81 L801.1 128.11,103.01 v128.11,102.06
  Bottom 0.203: v120.17,89.36 121.44,90.79 121.44,101.27 122.08,101.9 127.95,101.9 v128.11,102.06
CAN_SPLIT
  Top 0.203: R801.2 R802.1 C804.1
CAN_TRANS_0_EXT_SUPPLY
  Top 0.203: C803.2 120.86,94.54 120.87,94.53 IC801.3 | R803.1 125.57,92.22 124.78,93.01 C805.2 120.8,94.45 C803.2 | C803.2 120.64,94.6 115.41,94.6 114.61,93.8 C806.2 114.62,92.85 IC802.16 | 120.97,92.85 IC802.11
  Top 0.254: 120.97,92.85 C805.2
CAN_TRANS_0_STANDBY
  Top 0.203: R803.2 IC803.4 117.85,87.88 117.16,88.57 IC802.14
CONTACTOR_0_COIL_POS
  Top 0.152: X1201.3 53.67,109.96 53.67,110
  Top 1.016: F1001.2 53.18,92.85 52.7,93.33 52.7,103.81 53.67,104.77 D1001.K 53.67,110 53.67,110.07 53.74,110.14
CONTACTOR_0_CONTROL
  Top 0.152: R1001.2 62.6,54.22 63.02,53.8 89.06,53.8 89.69,54.44 92.23,54.44 92.55,54.12 92.55,51.9 92.23,51.58 91.12,51.58 IC402.133
CONTACTOR_0_FEEDBACK  (via drill 0.3)
  Top 0.152: v90.65,58.56 90.65,56.34 90.96,56.02 93.98,56.02 95.09,54.91 95.09,53.55 IC402.128
  Top 0.254: IC1102.14 v67.31,72.06
  Bottom 0.152: v67.31,72.06 64.45,72.06 64.14,71.74 64.14,63.01 64.61,62.53 90.01,62.53 90.65,61.9 v90.65,58.56
CONTACTOR_0_FEEDBACK_EXT
  Top 0.152: X1201.2 56.83,113.06 56.83,113.14
  Top 0.254: 56.74,113.14 56.83,113.14 59.09,113.14 59.69,112.54 R1101.1
CONTACTOR_1_COIL_POS
  Top 0.152: X1203.3 64.15,109.96 64.15,110
  Top 0.813: F1003.2 54.57,81.39
  Top 1.016: 54.57,81.39 56.04,82.85 56.04,87.77 60.01,91.74 60.01,105.39 60.48,105.87 63.82,105.87 64.15,106.2 D1003.K 64.15,110 64.15,110.07 64.22,110.14
CONTACTOR_1_CONTROL
  Top 0.152: R1007.2 67.53,54.54 67.94,54.12 88.9,54.12 89.53,54.75 92.71,54.75 93.07,54.39 IC402.132
CONTACTOR_1_FEEDBACK  (via drill 0.3)
  Top 0.152: v90.01,59.36 90.01,56.02 90.33,55.71 93.66,55.71 94.57,54.8 IC402.129
  Top 0.254: IC1102.13 v67.31,73.33
  Bottom 0.152: v67.31,73.33 64.45,73.33 63.66,72.53 63.66,62.85 64.29,62.22 89.38,62.22 90.01,61.58 v90.01,59.36
CONTACTOR_1_FEEDBACK_EXT
  Top 0.152: X1203.2 67.22,113.14
  Top 0.254: 67.22,113.14 69.57,113.14 70.17,112.54 R1102.1
CONTACTOR_2_COIL_POS
  Top 1.016: F1005.2 71.91,91.3 71.91,92.06 73.5,93.65 73.5,103.65 74.63,104.77 D1005.K 74.7,107.94 X1205.3 74.7,110.14
CONTACTOR_2_CONTROL
  Top 0.152: R1013.2 72.45,54.86 72.87,54.44 88.74,54.44 89.38,55.07 93.03,55.07 93.57,54.53 IC402.131
CONTACTOR_2_FEEDBACK  (via drill 0.3)
  Top 0.152: v89.38,58.56 89.38,55.86 89.85,55.39 93.34,55.39 94.07,54.66 IC402.130
  Top 0.254: IC1102.12 v67.31,74.6
  Bottom 0.152: v67.31,74.6 64.77,74.6 63.18,73.17 63.18,62.69 63.98,61.9 88.9,61.9 89.38,61.42 v89.38,58.56
CONTACTOR_2_FEEDBACK_EXT
  Top 0.152: 77.7,113.14 X1205.2
  Top 0.254: 77.7,113.14 80.04,113.14 80.64,112.54 R1103.1
CONTACTOR_3_COIL_POS
  Top 1.016: F1002.2 83.82,97.42 83.82,103.81 85.1,105.09 D1002.K 85.18,107.94 X1202.3 85.18,110.14
CONTACTOR_3_CONTROL
  Top 0.152: R1002.2 77.37,55.17 77.79,54.75 88.27,54.75 88.74,55.23 88.74,60.63 88.9,60.79 98.74,60.79 99.06,60.47 99.06,53.55 IC402.120
CONTACTOR_3_FEEDBACK  (via drill 0.3)
  Top 0.152: IC402.115 101.62,59.7 v101.76,59.83
  Top 0.254: IC1103.14 v92.08,72.06
  Bottom 0.152: v92.08,72.06 89.53,72.06 88.9,71.42 88.9,65.55 89.06,65.39 91.28,65.39 91.76,64.91 91.76,62.85 92.08,62.53 101.12,62.53 101.76,61.9 v101.76,59.83
CONTACTOR_3_FEEDBACK_EXT
  Top 0.152: 88.18,113.14 X1202.2
  Top 0.254: 88.18,113.14 90.52,113.14 91.12,112.54 R1104.2
CONTACTOR_4_COIL_POS
  Top 1.016: F1004.2 93.98,92.54 94.77,93.33 94.77,98.73 95.58,99.53 D1004.K 95.66,107.94 X1204.3 95.66,110 95.66,110.14
CONTACTOR_4_CONTROL